# EasyEDA schematic CERBERUS 2100 EasyEDA Schematics.json

## Sheets
1 PSU/IO: TITLE: CERBERUS 2100™, power and interfaces; REV: 1.0; Date: 2023-06-28; Sheet: 1/5; Drawn By: Bernardo Kastrup; Company: The Byte Attic
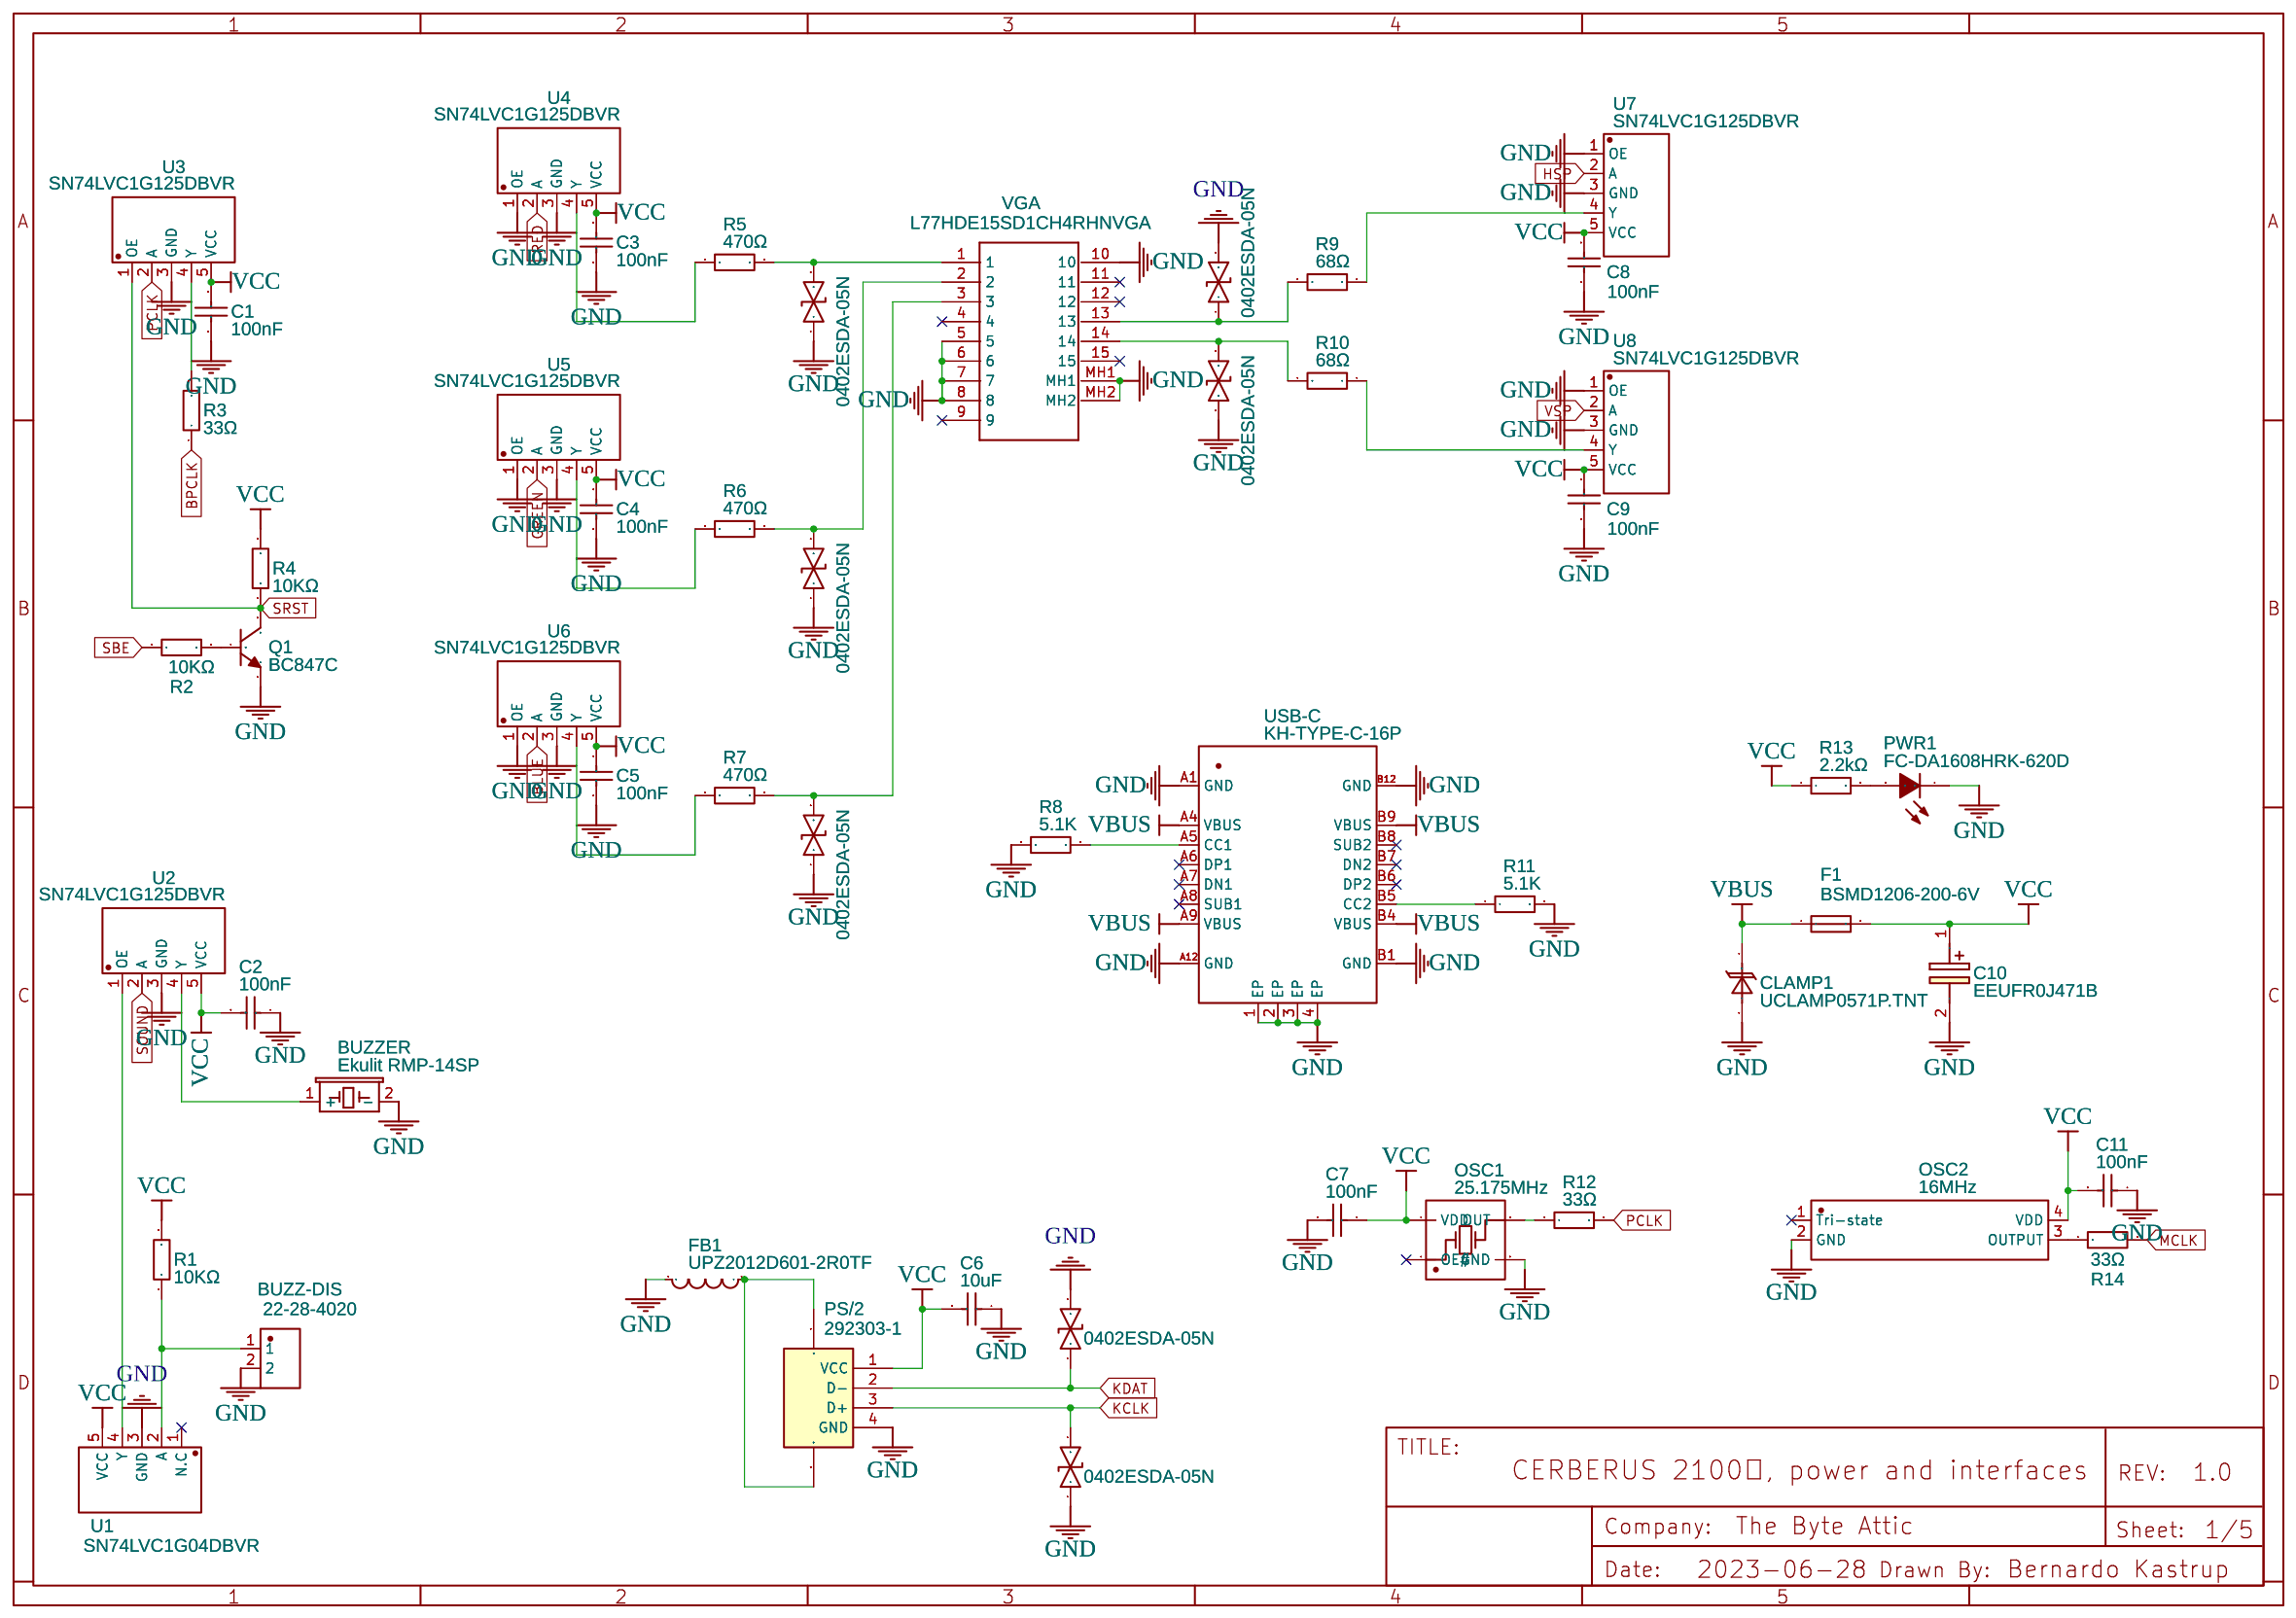
[diagram p0: PSU/IO]
2 VIDEO: TITLE: CERBERUS 2100™, video circuit; Sheet: 2/5
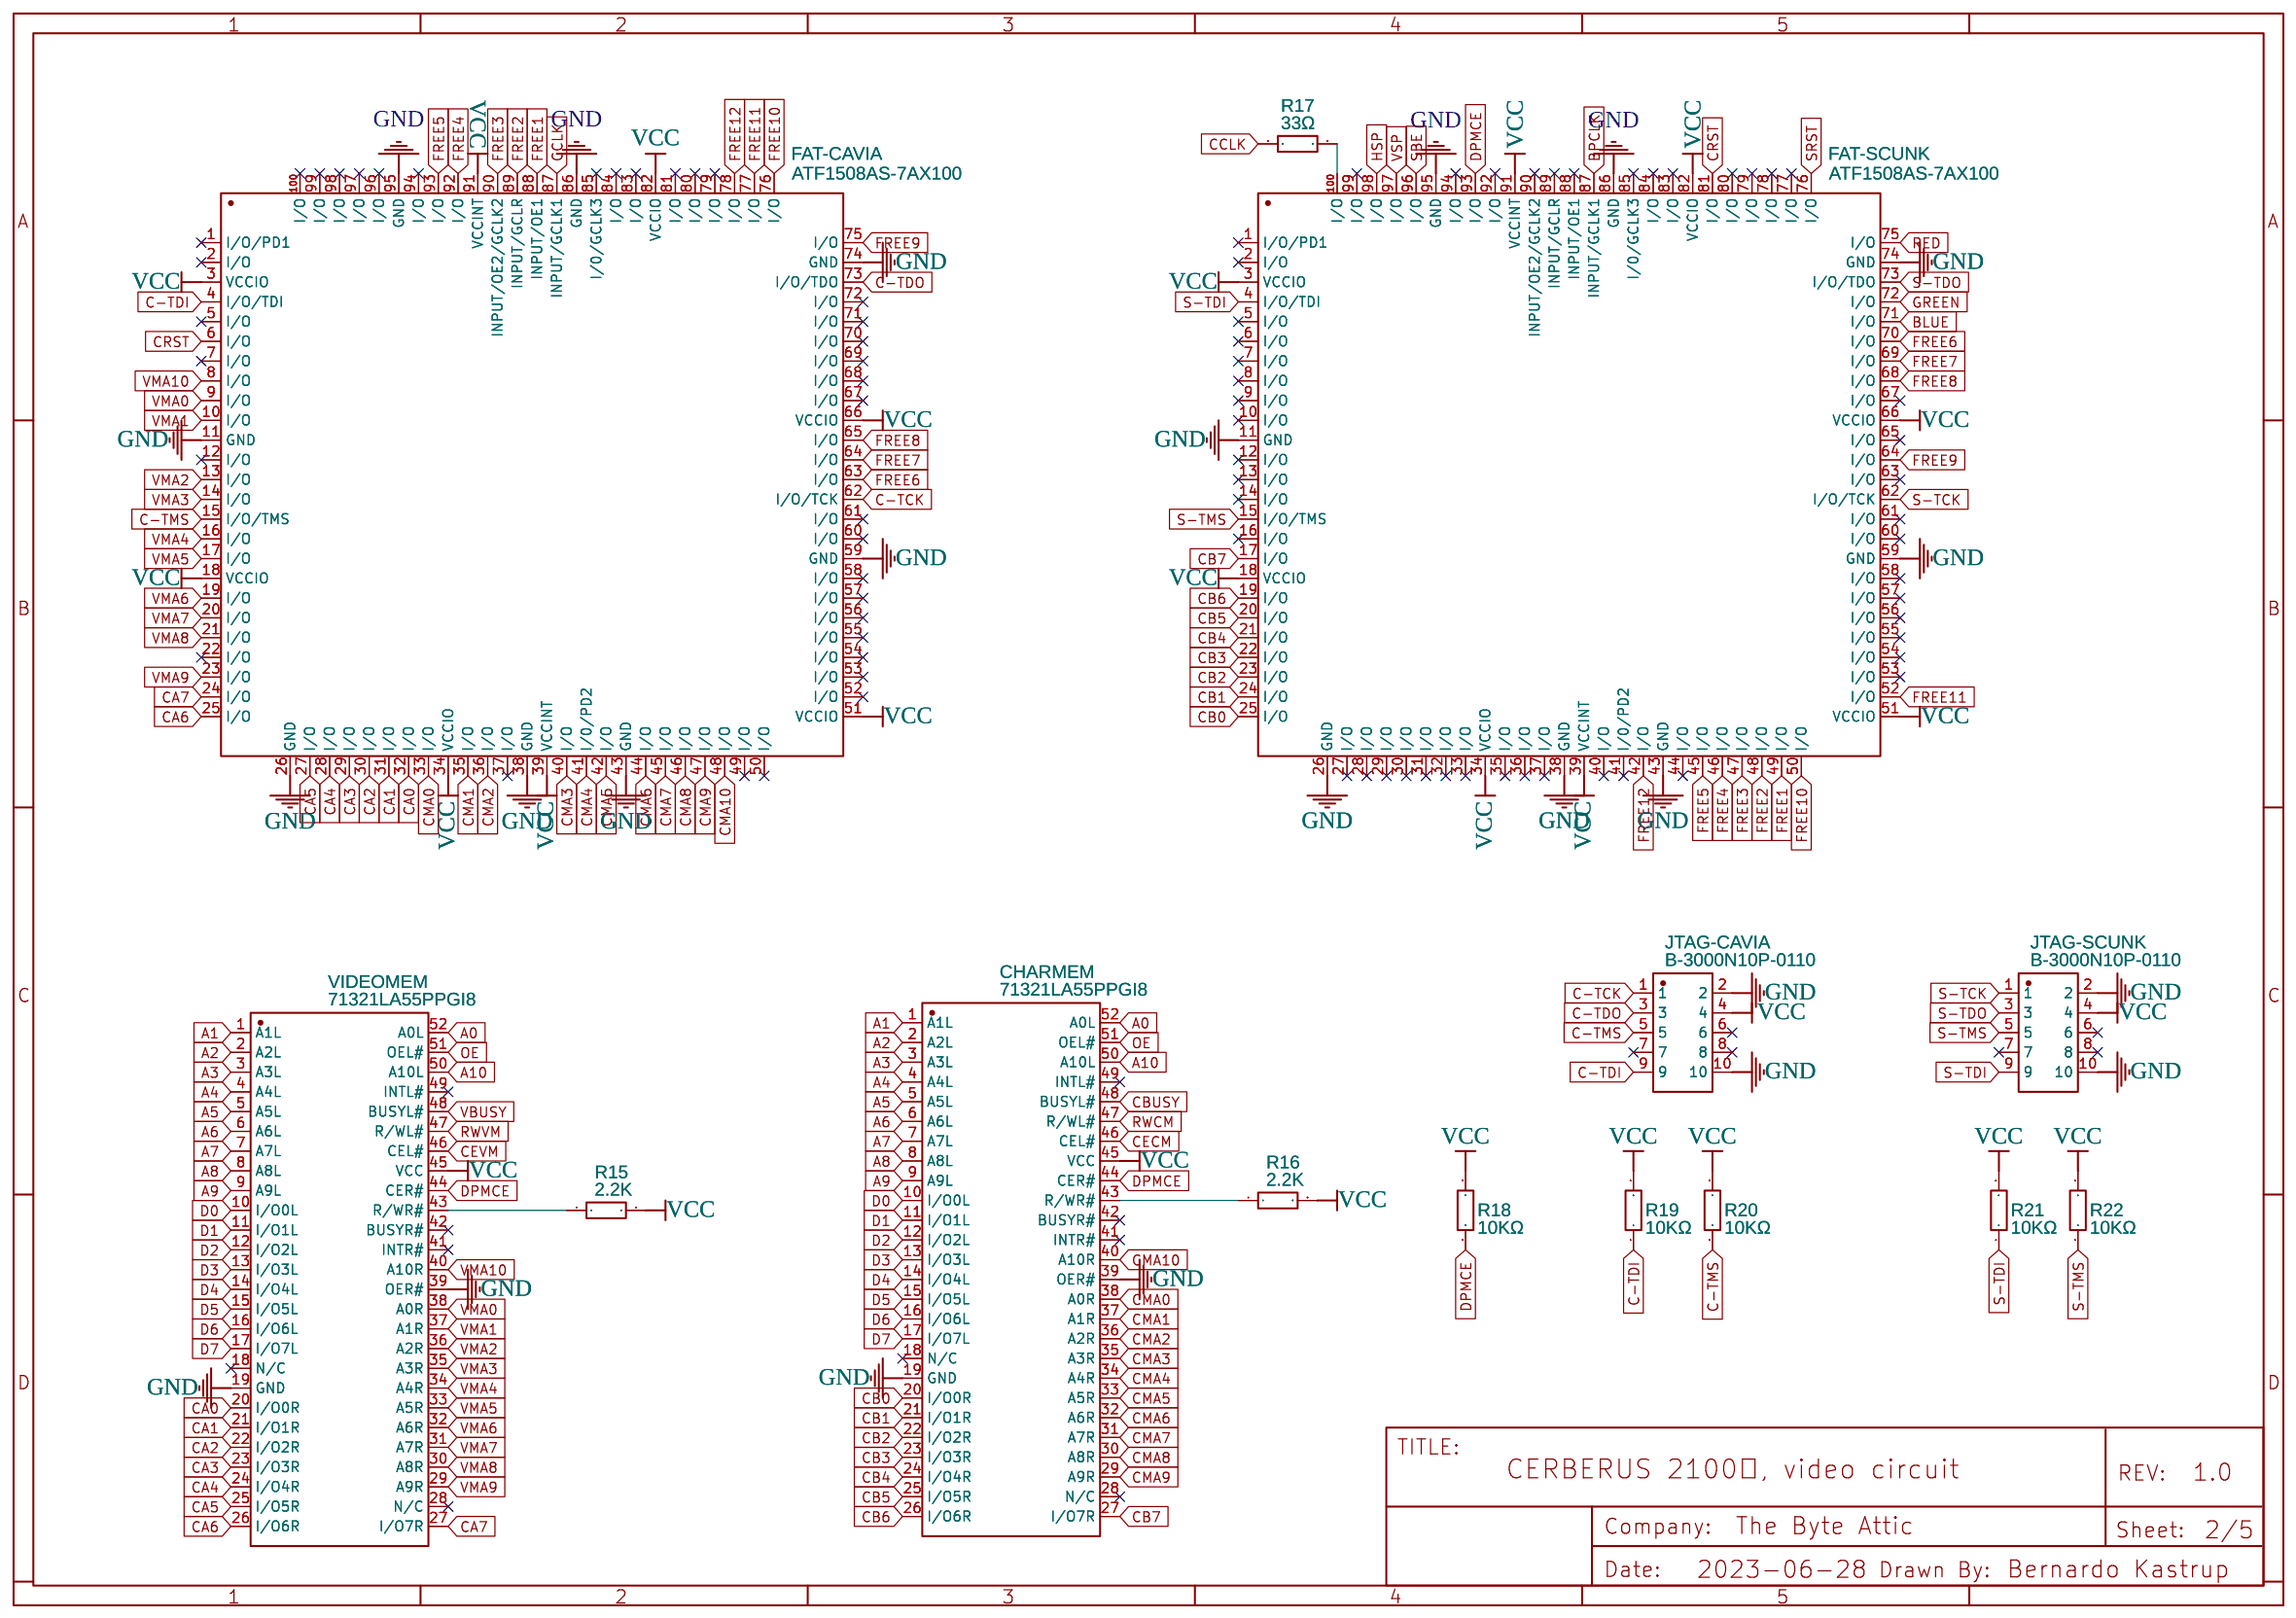
[diagram p1: VIDEO]
3 COMP: TITLE: CERBERUS 2100™, computer proper; Sheet: 3/5
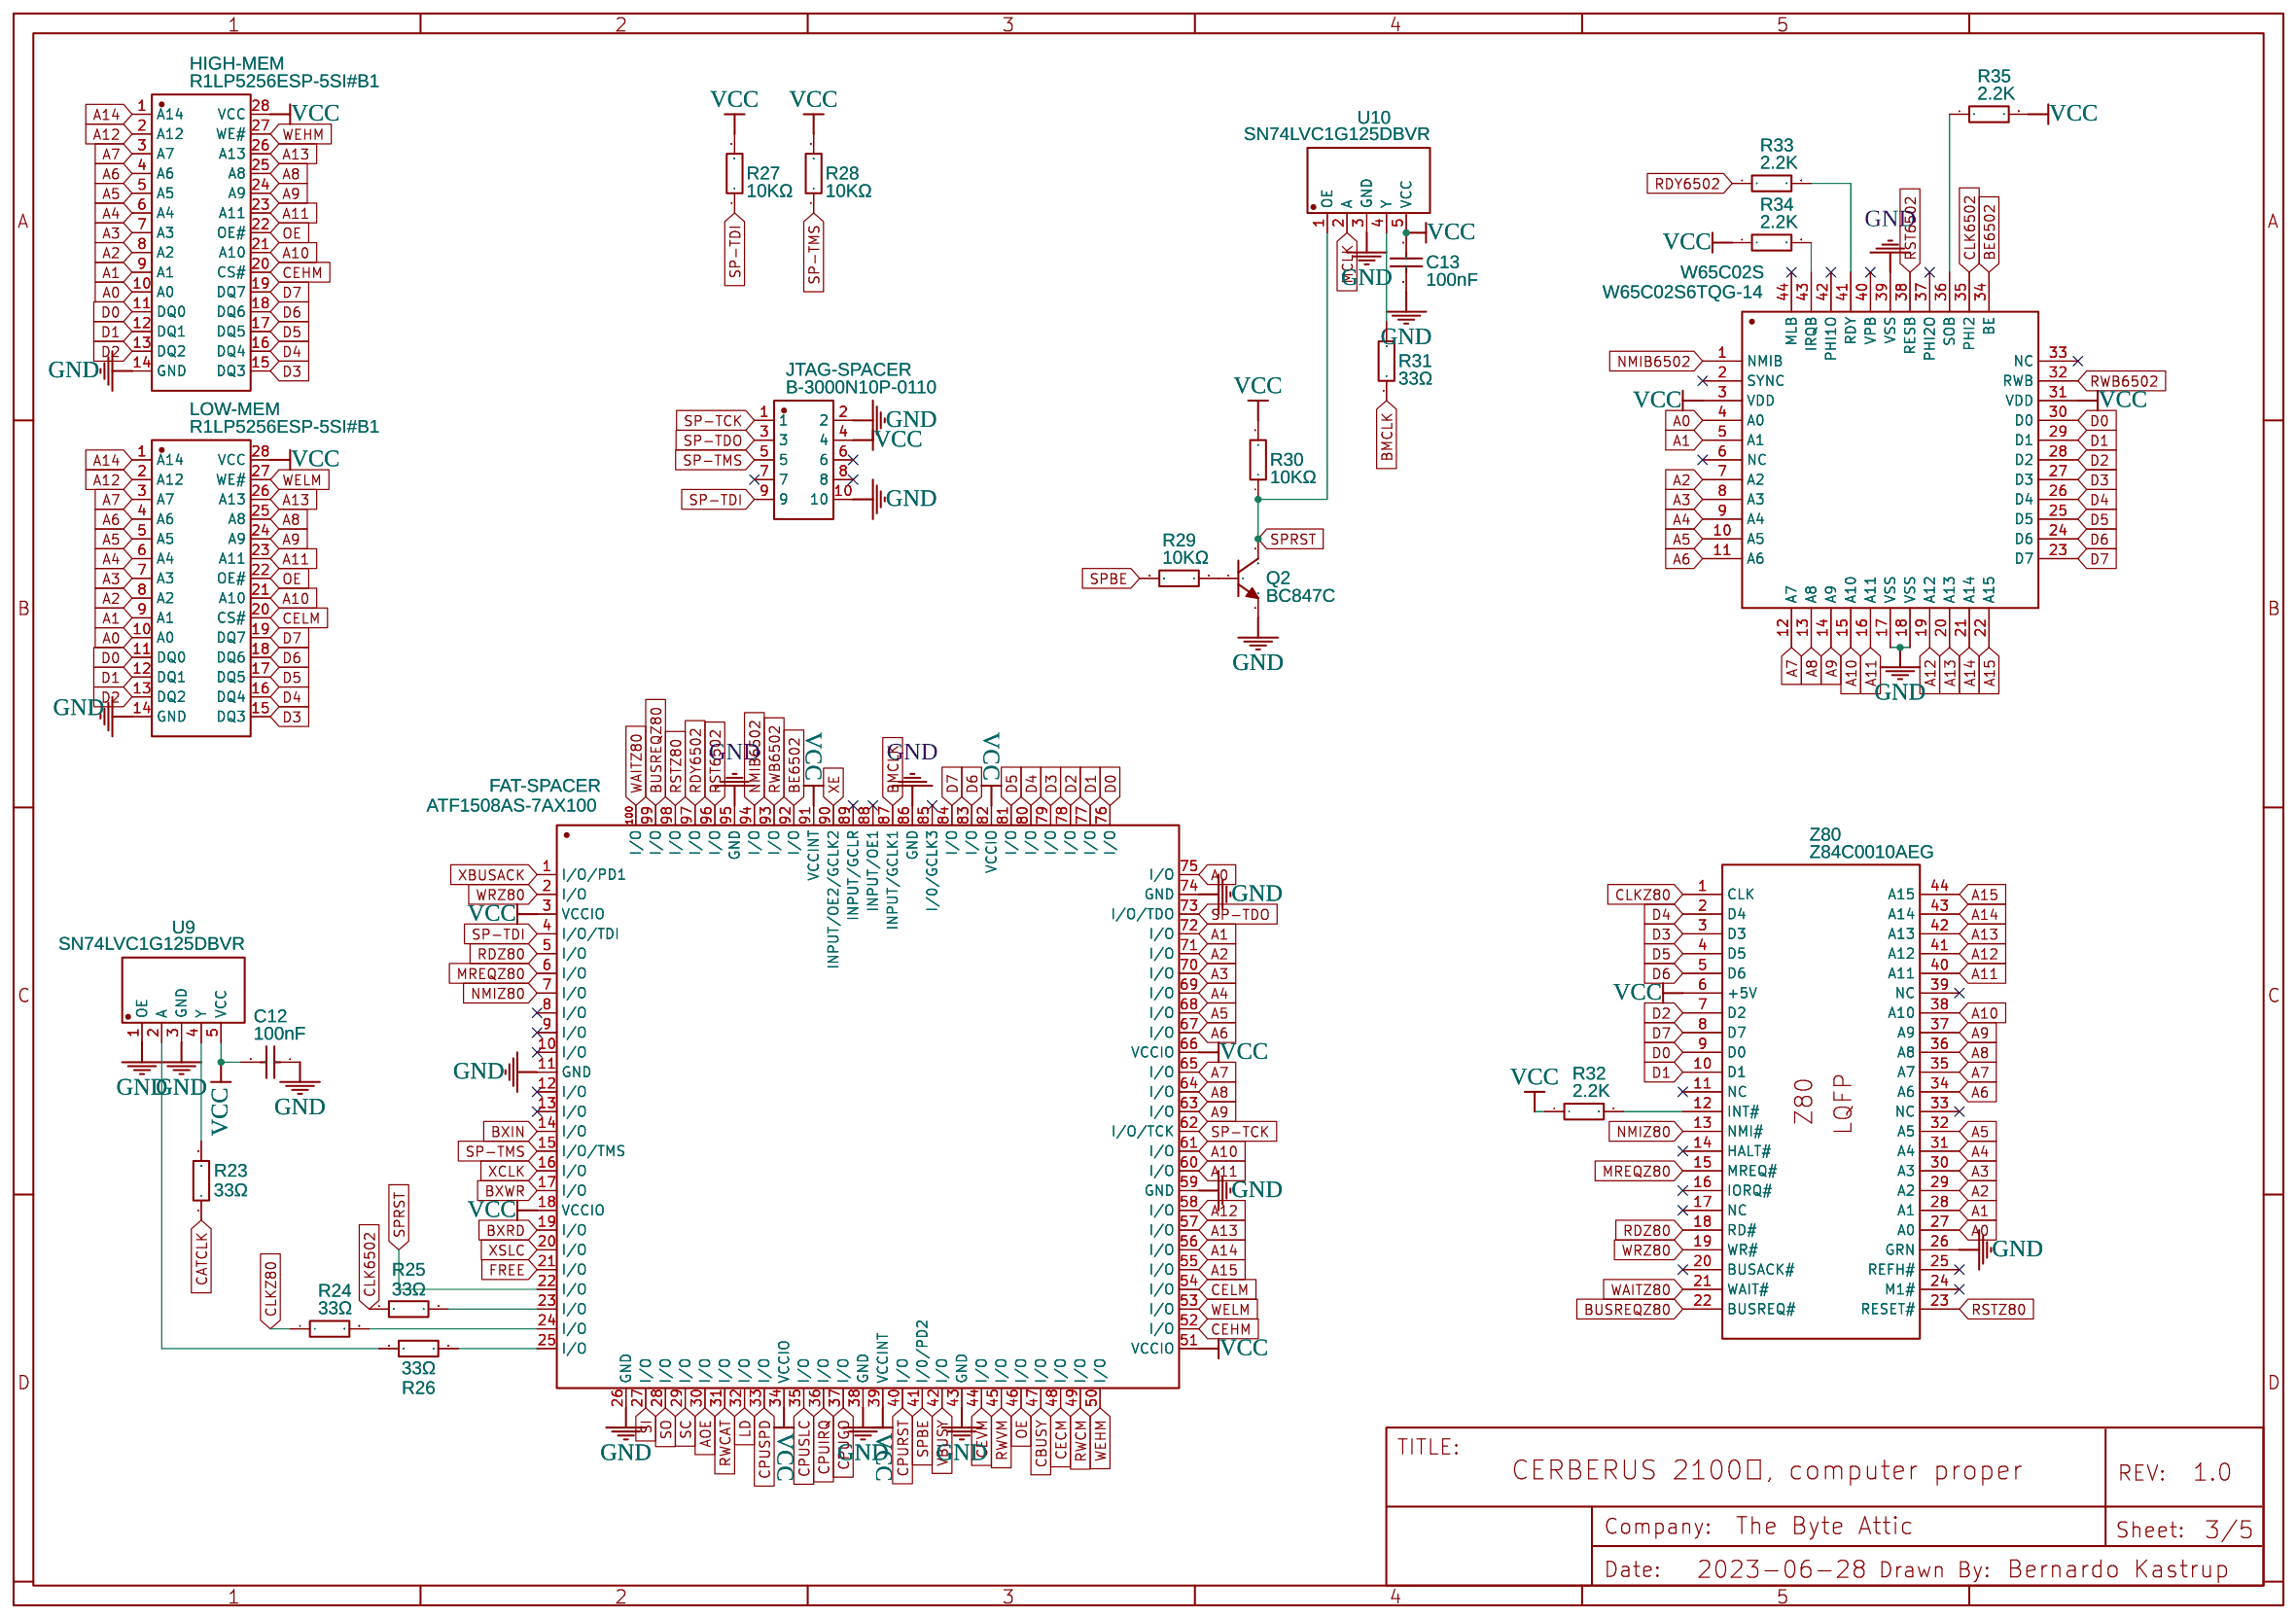
[diagram p2: COMP]
4 IO CTRL: TITLE: CERBERUS 2100™ I/O controller; Sheet: 4/5
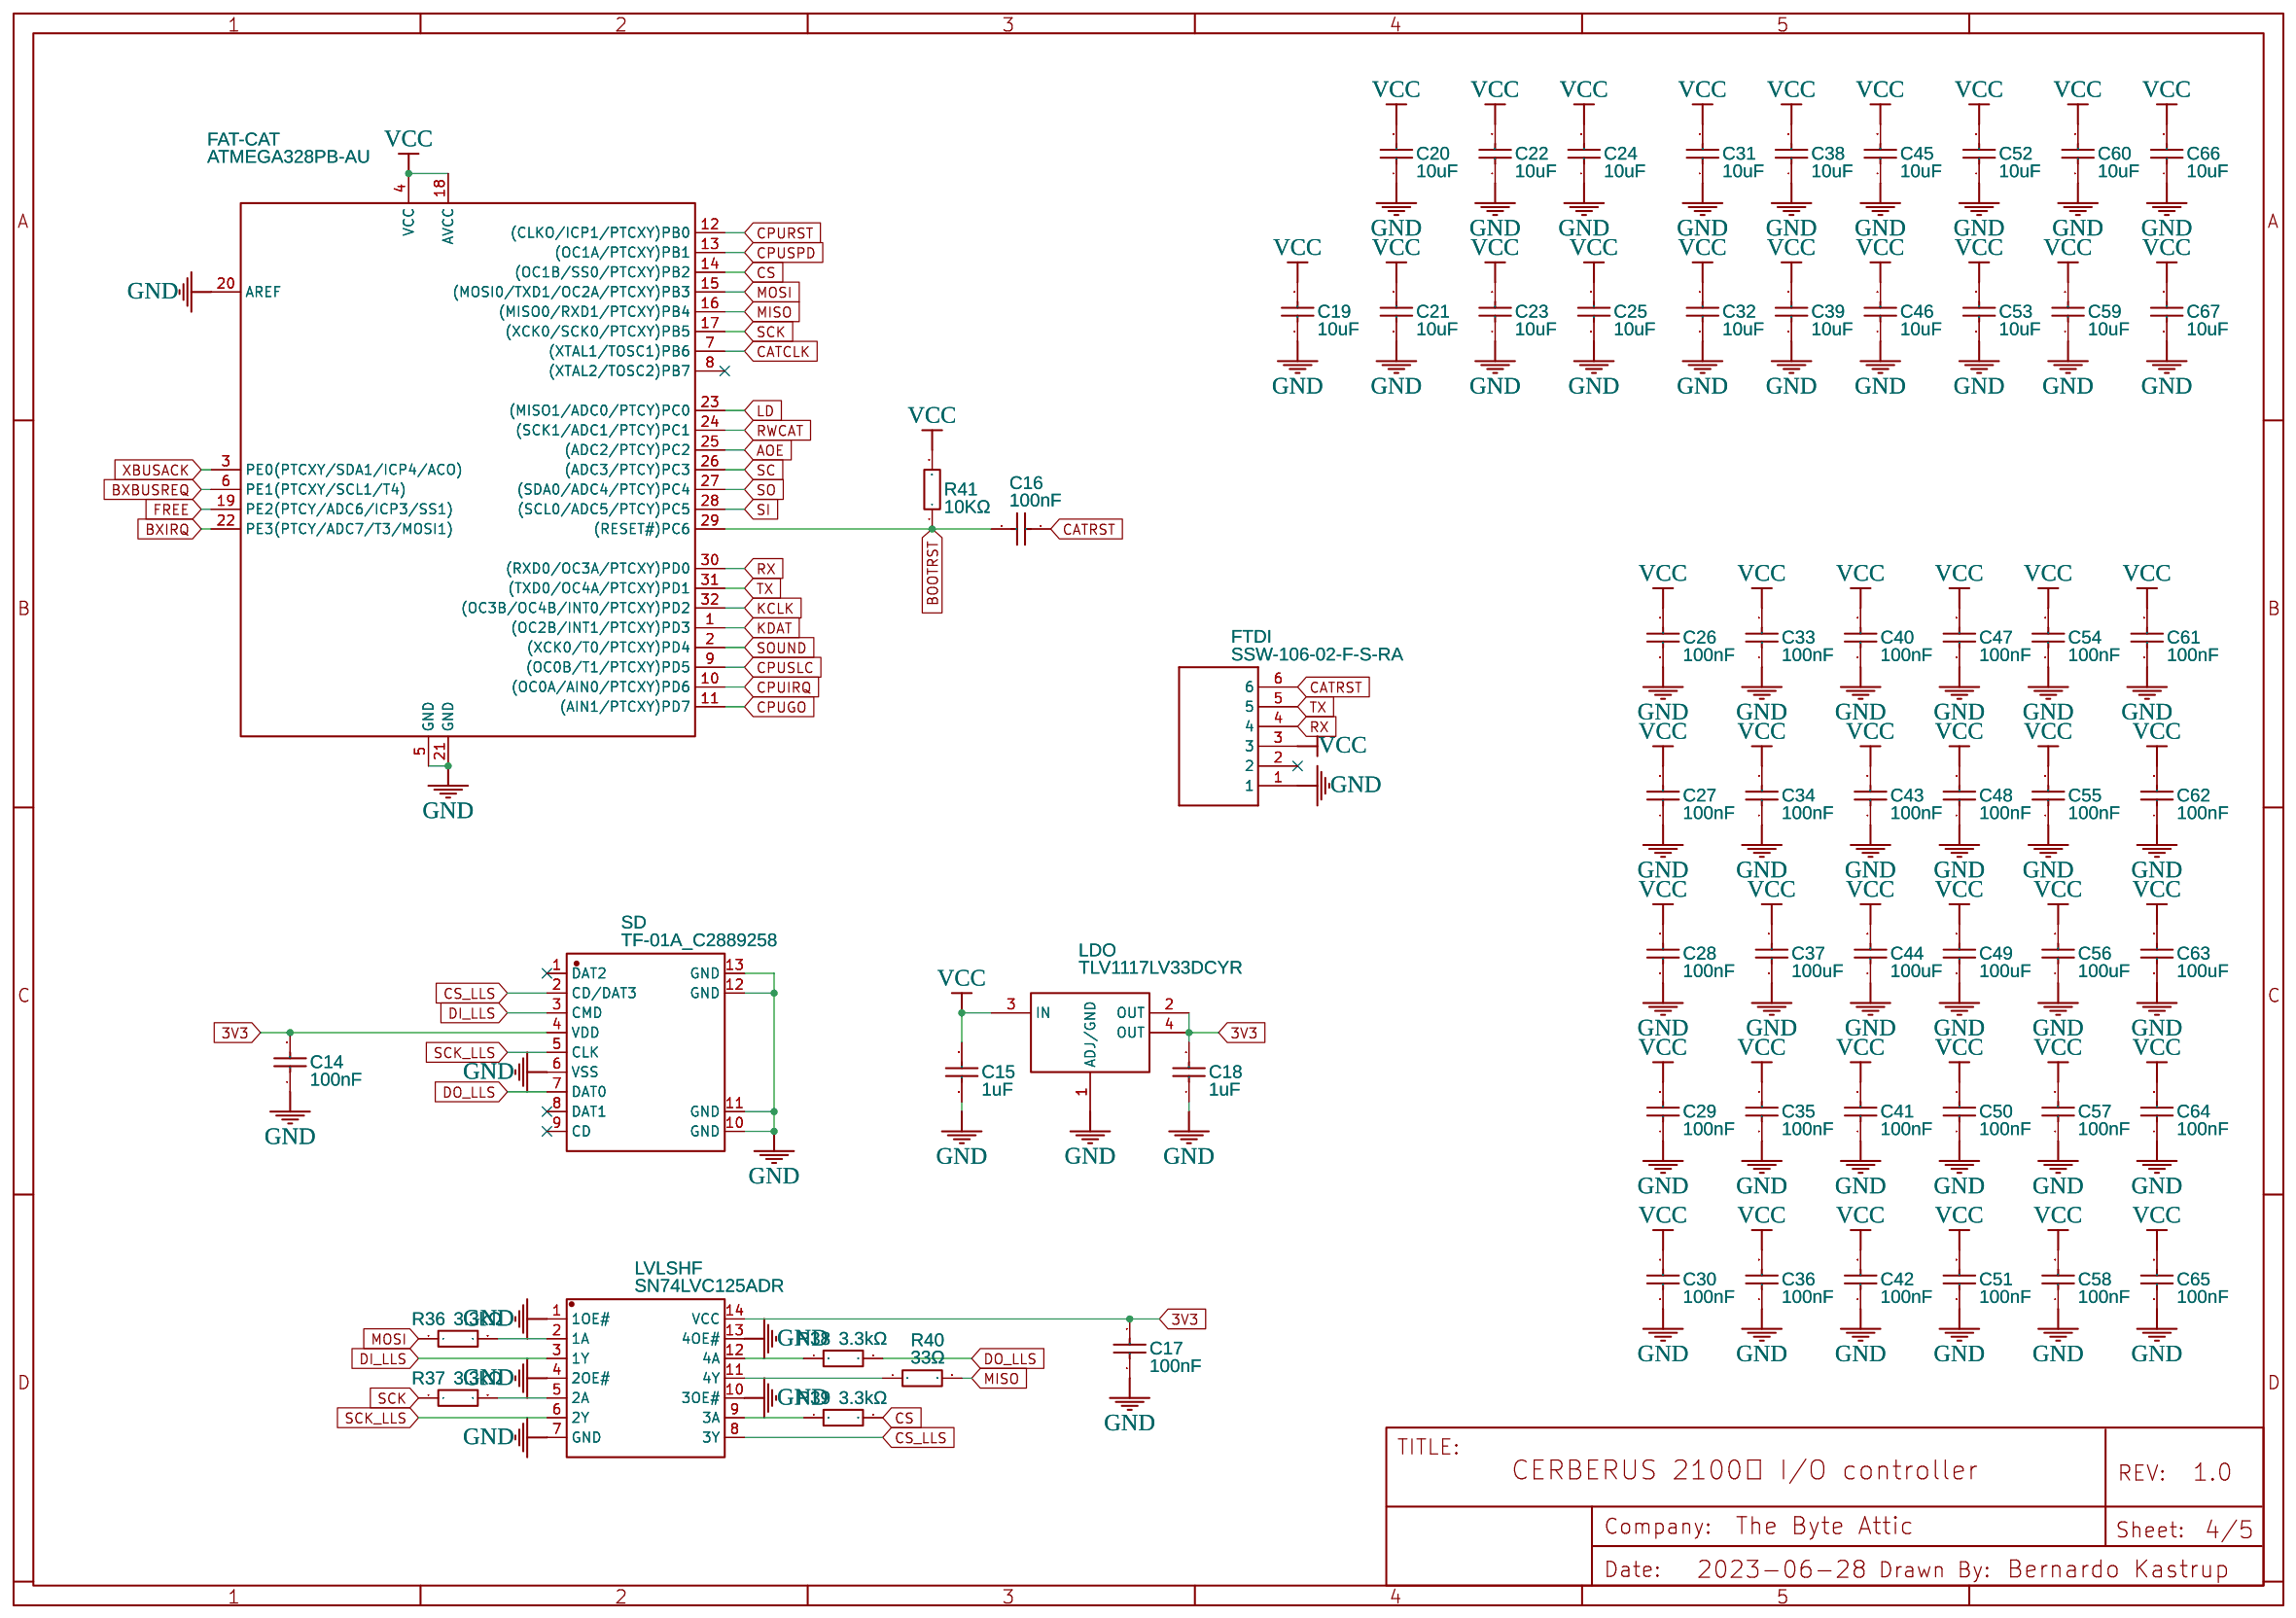
[diagram p3: IO CTRL]
5 EXP: TITLE: CERBERUS2080™, bus expansion; Sheet: 5/5
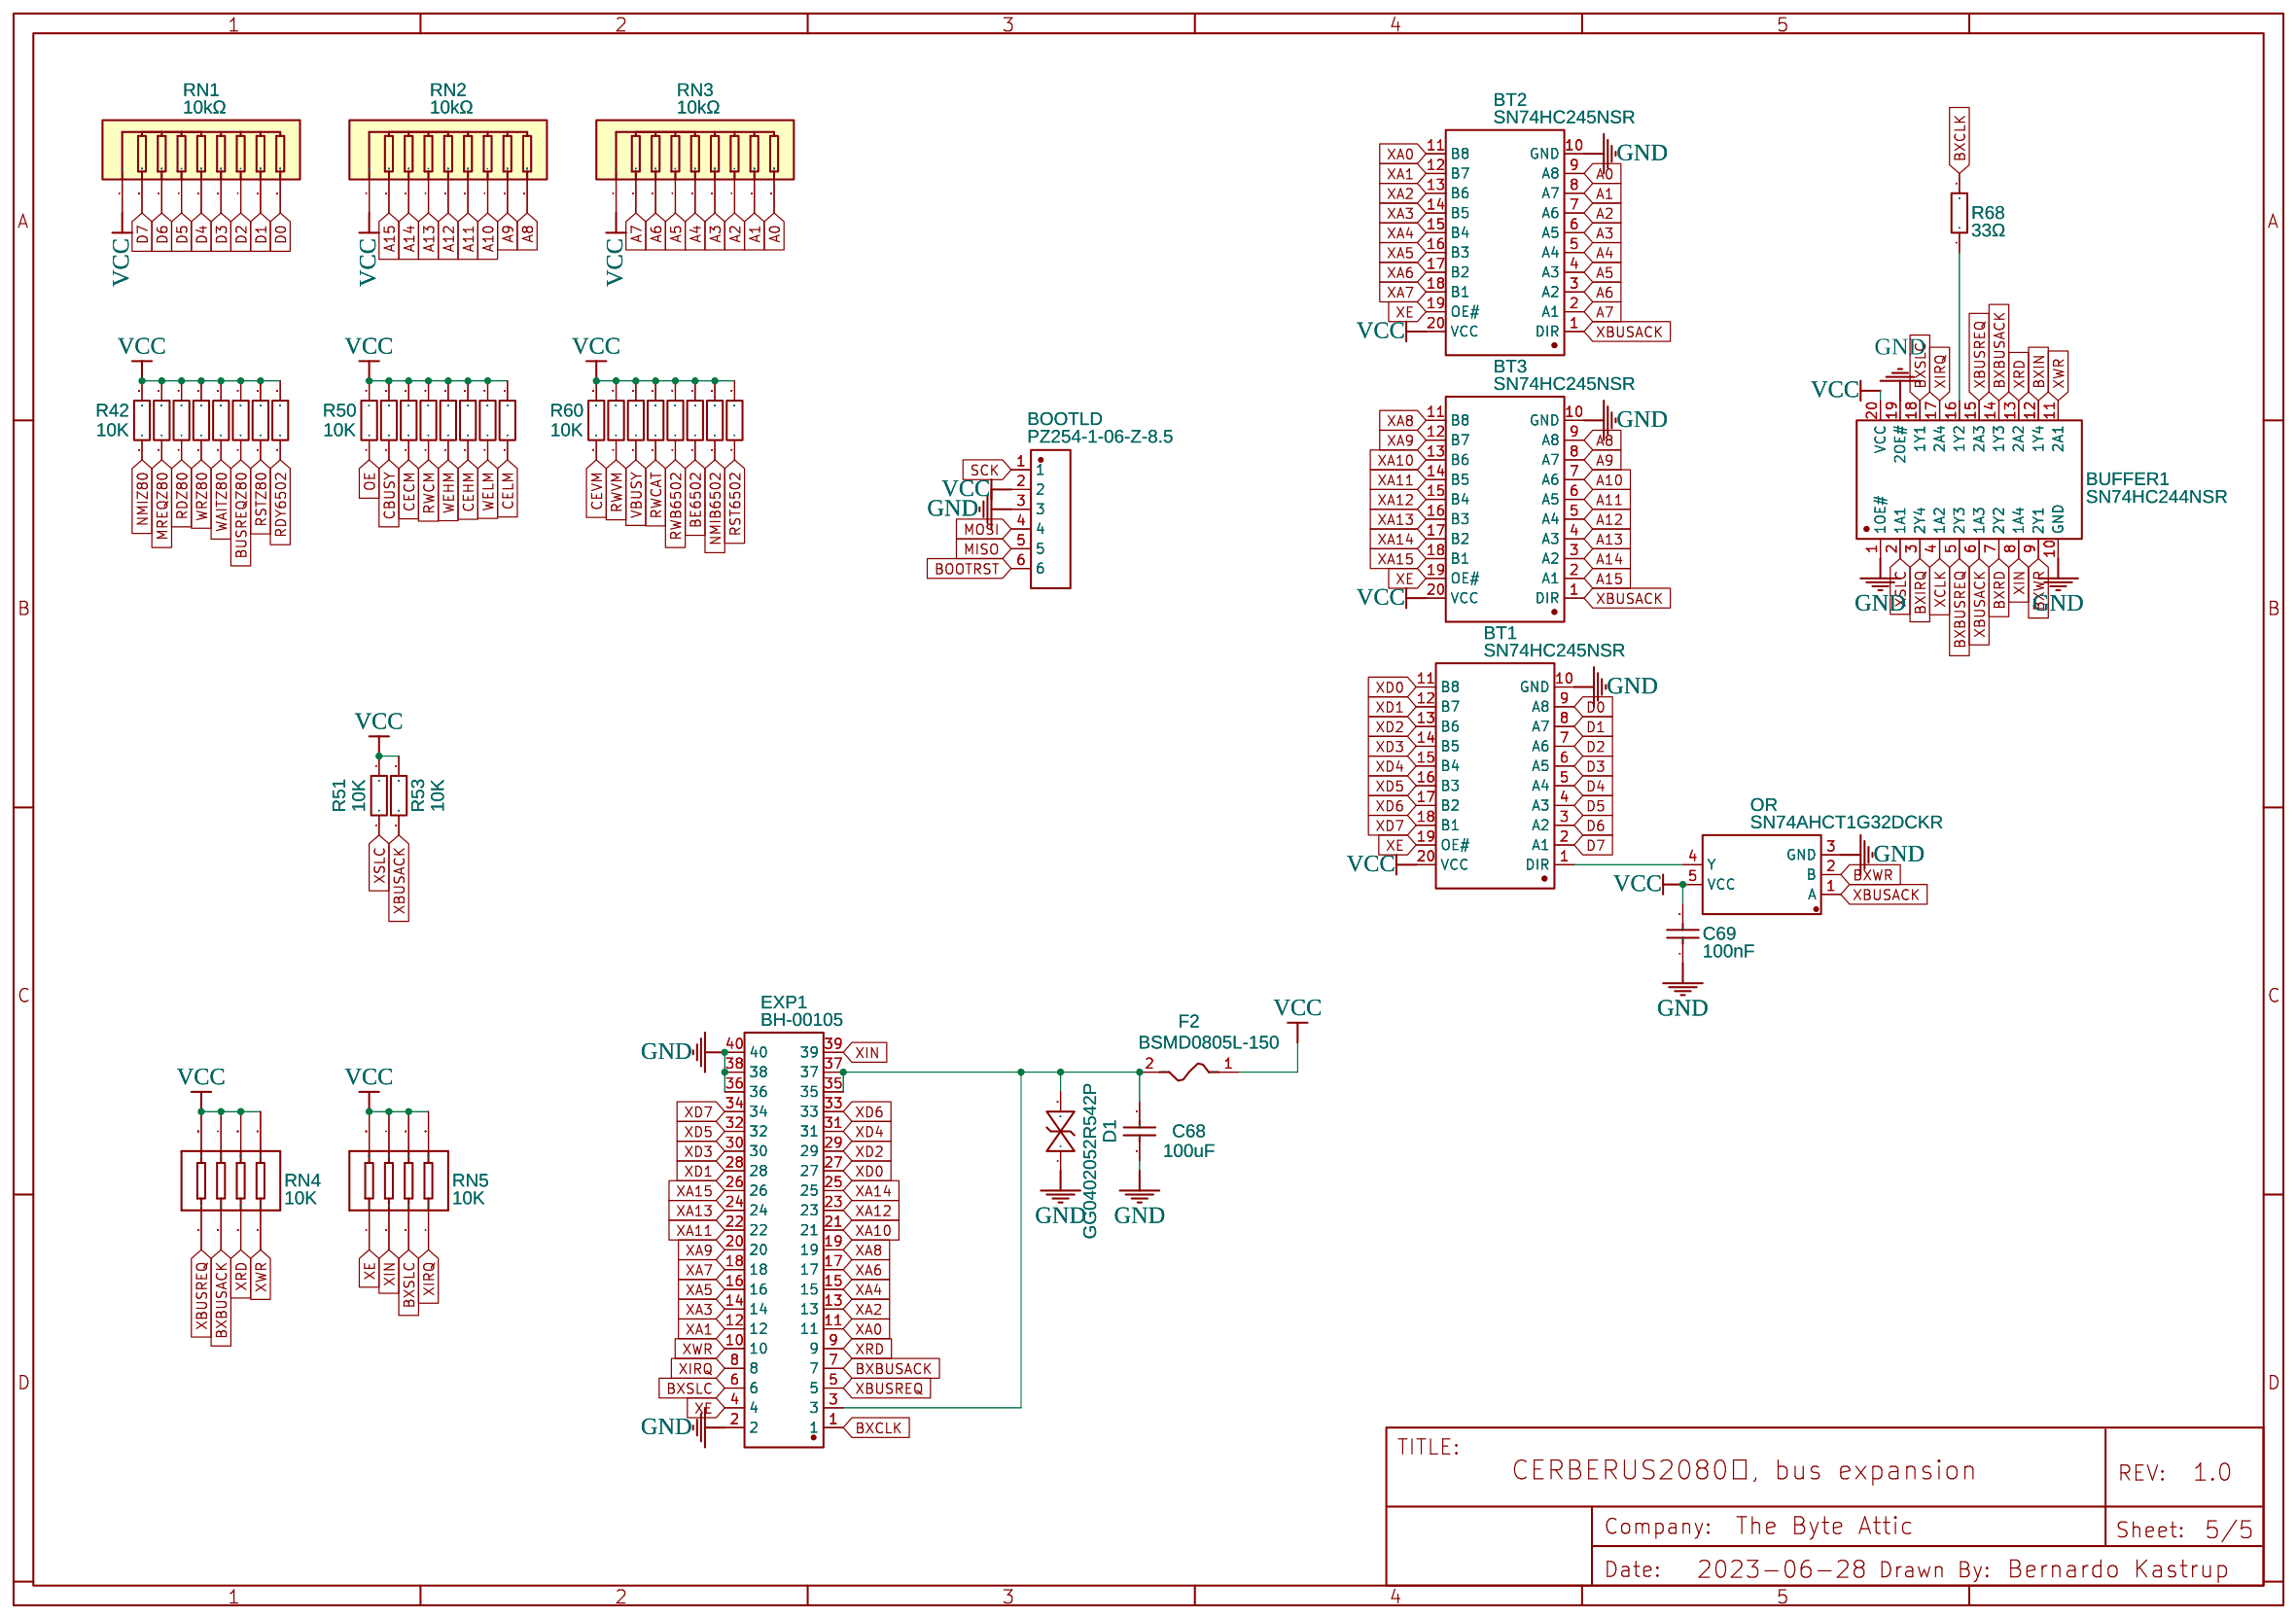
[diagram p4: EXP]

## Parts
sheet COMP
C12  100nF  [C0402_NEW]
C13  100nF  [C0402_NEW]
FAT-SPACER  ATF1508AS-7AX100  [TQFP-100_L14.0-W14.0-P0.50-LS16.0-BL]
HIGH-MEM  R1LP5256ESP-5SI#B1  [SOP-28_L17.5-W8.4-P1.27-LS12.0-BL]
JTAG-SPACER  B-3000N10P-0110  [CONN-SMD_10P-P2.54_B-3000N10P-0110]
LOW-MEM  R1LP5256ESP-5SI#B1  [SOP-28_L17.5-W8.4-P1.27-LS12.0-BL]
Q2  BC847C  [SOT-23-3_L2.9-W1.6-P1.90-LS2.8-BR]
R23  33Ω  [R0402]
R24  33Ω  [R0402]
R25  33Ω  [R0402]
R26  33Ω  [R0402]
R27  10KΩ  [R0402]
R28  10KΩ  [R0402]
R29  10KΩ  [R0402]
R30  10KΩ  [R0402]
R31  33Ω  [R0402]
R32  2.2K  [R0402]
R33  2.2K  [R0402]
R34  2.2K  [R0402]
R35  2.2K  [R0402]
U9  SN74LVC1G125DBVR  [SOT-23-5_L3.0-W1.7-P0.95-LS2.8-BR]
U10  SN74LVC1G125DBVR  [SOT-23-5_L3.0-W1.7-P0.95-LS2.8-BR]
W65C02S  W65C02S6TQG-14  [LQFP-44_L10.0-W10.0-P0.80-LS13.6-BL]
Z80  Z84C0010AEG  [LQFP-44_L10.0-W10.0-P0.80-LS13.6-BL]
sheet EXP
BOOTLD  PZ254-1-06-Z-8.5  [HDR-TH_06P-P2.54-V-M]
BT1  SN74HC245NSR  [SOIC-20_L13.3-W5.5-P1.27-LS7.8-BL]
BT2  SN74HC245NSR  [SOIC-20_L13.3-W5.5-P1.27-LS7.8-BL]
BT3  SN74HC245NSR  [SOIC-20_L13.3-W5.5-P1.27-LS7.8-BL]
BUFFER1  SN74HC244NSR  [SOIC-20_L13.3-W5.5-P1.27-LS7.8-BL]
C68  100uF  [C1210]
C69  100nF  [C0402_NEW]
D1  GG0402052R542P  [D0402-BI]
EXP1  BH-00105  [IDC-SMD_BH-00105]
F2  BSMD0805L-150  [F0805]
OR  SN74AHCT1G32DCKR  [SC-70-5_L2.1-W1.3-P0.65-LS2.1-BL]
R42  10K  [R0402]
R43  10K  [R0402]
R44  10K  [R0402]
R45  10K  [R0402]
R46  10K  [R0402]
R47  10K  [R0402]
R48  10K  [R0402]
R49  10K  [R0402]
R50  10K  [R0402]
R51  10K  [R0402]
R52  10K  [R0402]
R53  10K  [R0402]
R54  10K  [R0402]
R55  10K  [R0402]
R56  10K  [R0402]
R57  10K  [R0402]
R58  10K  [R0402]
R59  10K  [R0402]
R60  10K  [R0402]
R61  10K  [R0402]
R62  10K  [R0402]
R63  10K  [R0402]
R64  10K  [R0402]
R65  10K  [R0402]
R66  10K  [R0402]
R67  10K  [R0402]
R68  33Ω  [R0402]
RN1  10kΩ  [RES-ARRAY-TH_9P-P2.54-D1.0]
RN2  10kΩ  [RES-ARRAY-TH_9P-P2.54-D1.0]
RN3  10kΩ  [RES-ARRAY-TH_9P-P2.54-D1.0]
RN4  10K  [RES-ARRAY-SMD_0603-8P-L3.2-W1.6-BL]
RN5  10K  [RES-ARRAY-SMD_0603-8P-L3.2-W1.6-BL]
sheet IO CTRL
C14  100nF  [C0402_NEW]
C15  1uF  [C0402]
C16  100nF  [C0402_NEW]
C17  100nF  [C0402_NEW]
C18  1uF  [C0402]
C19  10uF  [C0402]
C20  10uF  [C0402]
C21  10uF  [C0402]
C22  10uF  [C0402]
C23  10uF  [C0402]
C24  10uF  [C0402]
C25  10uF  [C0402]
C26  100nF  [C0402_NEW]
C27  100nF  [C0402_NEW]
C28  100nF  [C0402_NEW]
C29  100nF  [C0402_NEW]
C30  100nF  [C0402_NEW]
C31  10uF  [C0402]
C32  10uF  [C0402]
C33  100nF  [C0402_NEW]
C34  100nF  [C0402_NEW]
C35  100nF  [C0402_NEW]
C36  100nF  [C0402_NEW]
C37  100uF  [C1210]
C38  10uF  [C0402]
C39  10uF  [C0402]
C40  100nF  [C0402_NEW]
C41  100nF  [C0402_NEW]
C42  100nF  [C0402_NEW]
C43  100nF  [C0402_NEW]
C44  100uF  [C1210]
C45  10uF  [C0402]
C46  10uF  [C0402]
C47  100nF  [C0402_NEW]
C48  100nF  [C0402_NEW]
C49  100uF  [C1210]
C50  100nF  [C0402_NEW]
C51  100nF  [C0402_NEW]
C52  10uF  [C0402]
C53  10uF  [C0402]
C54  100nF  [C0402_NEW]
C55  100nF  [C0402_NEW]
C56  100uF  [C1210]
C57  100nF  [C0402_NEW]
C58  100nF  [C0402_NEW]
C59  10uF  [C0402]
C60  10uF  [C0402]
C61  100nF  [C0402_NEW]
C62  100nF  [C0402_NEW]
C63  100uF  [C1210]
C64  100nF  [C0402_NEW]
C65  100nF  [C0402_NEW]
C66  10uF  [C0402]
C67  10uF  [C0402]
FAT-CAT  ATMEGA328PB-AU  [TQFP-32_L7.0-W7.0-P0.80-LS9.0-BL]
FTDI  SSW-106-02-F-S-RA  [SSW-106-XX-YYY-S-RA]
LDO  TLV1117LV33DCYR  [SOT-223_L6.7-W3.5-P2.30-BR]
LVLSHF  SN74LVC125ADR  [SOIC-14_L8.7-W3.9-P1.27-LS6.0-BL]
R36  3.3kΩ  [R0402]
R37  3.3kΩ  [R0402]
R38  3.3kΩ  [R0402]
R39  3.3kΩ  [R0402]
R40  33Ω  [R0402]
R41  10KΩ  [R0402]
SD  TF-01A_C2889258  [TF-SMD_TF-02]
sheet PSU/IO
BUZZ-DIS  22-28-4020  [HDR-TH_2P-P2.54-V-M-1]
BUZZER  Ekulit RMP-14SP  [BUZZER-R14-2P-7.6PITCH]
C1  100nF  [C0402_NEW]
C2  100nF  [C0402_NEW]
C3  100nF  [C0402_NEW]
C4  100nF  [C0402_NEW]
C5  100nF  [C0402_NEW]
C6  10uF  [C0402]
C7  100nF  [C0402_NEW]
C8  100nF  [C0402_NEW]
C9  100nF  [C0402_NEW]
C10  EEUFR0J471B  [CAPPRD250W55D630H1270]
C11  100nF  [C0402_NEW]
CLAMP1  UCLAMP0571P.TNT  [SGP1610N2_L1.6-W1.0-P1.1-RD]
ESD1  0402ESDA-05N  [D0402-BI]
ESD2  0402ESDA-05N  [D0402-BI]
ESD3  0402ESDA-05N  [D0402-BI]
ESD4  0402ESDA-05N  [D0402-BI]
ESD5  0402ESDA-05N  [D0402-BI]
ESD6  0402ESDA-05N  [D0402-BI]
ESD7  0402ESDA-05N  [D0402-BI]
F1  BSMD1206-200-6V  [F1206]
FB1  UPZ2012D601-2R0TF  [L0805]
OSC1  25.175MHz  [OSC-SMD_4P-L7.0-W5.0-BL]
OSC2  16MHz  [OSC-SMD_4P-L7.0-W5.0-BL]
PS/2  292303-1  [USB-A-TH_USB-302-T]
PWR1  FC-DA1608HRK-620D  [LED0603-RD_RED]
Q1  BC847C  [SOT-23-3_L2.9-W1.6-P1.90-LS2.8-BR]
R1  10KΩ  [R0402]
R2  10KΩ  [R0402]
R3  33Ω  [R0402]
R4  10KΩ  [R0402]
R5  470Ω  [R0603]
R6  470Ω  [R0603]
R7  470Ω  [R0603]
R8  5.1K  [R0603]
R9  68Ω  [R0402]
R10  68Ω  [R0402]
R11  5.1K  [R0603]
R12  33Ω  [R0402]
R13  2.2kΩ  [R0603]
R14  33Ω  [R0402]
U1  SN74LVC1G04DBVR  [SOT-23-5_L3.0-W1.7-P0.95-LS2.8-BR]
U2  SN74LVC1G125DBVR  [SOT-23-5_L3.0-W1.7-P0.95-LS2.8-BR]
U3  SN74LVC1G125DBVR  [SOT-23-5_L3.0-W1.7-P0.95-LS2.8-BR]
U4  SN74LVC1G125DBVR  [SOT-23-5_L3.0-W1.7-P0.95-LS2.8-BR]
U5  SN74LVC1G125DBVR  [SOT-23-5_L3.0-W1.7-P0.95-LS2.8-BR]
U6  SN74LVC1G125DBVR  [SOT-23-5_L3.0-W1.7-P0.95-LS2.8-BR]
U7  SN74LVC1G125DBVR  [SOT-23-5_L3.0-W1.7-P0.95-LS2.8-BR]
U8  SN74LVC1G125DBVR  [SOT-23-5_L3.0-W1.7-P0.95-LS2.8-BR]
USB-C  KH-TYPE-C-16P  [USB-C-SMD_KH-TYPE-C-16P]
VGA  L77HDE15SD1CH4RHNVGA  [L77HDE15SD1CH4RHNVGA]
sheet VIDEO
CHARMEM  71321LA55PPGI8  [LQFP-52_L10.0-W10.0-P0.65-LS12.0-BL]
FAT-CAVIA  ATF1508AS-7AX100  [TQFP-100_L14.0-W14.0-P0.50-LS16.0-BL]
FAT-SCUNK  ATF1508AS-7AX100  [TQFP-100_L14.0-W14.0-P0.50-LS16.0-BL]
JTAG-CAVIA  B-3000N10P-0110  [CONN-SMD_10P-P2.54_B-3000N10P-0110]
JTAG-SCUNK  B-3000N10P-0110  [CONN-SMD_10P-P2.54_B-3000N10P-0110]
R15  2.2K  [R0402]
R16  2.2K  [R0402]
R17  33Ω  [R0402]
R18  10KΩ  [R0402]
R19  10KΩ  [R0402]
R20  10KΩ  [R0402]
R21  10KΩ  [R0402]
R22  10KΩ  [R0402]
VIDEOMEM  71321LA55PPGI8  [LQFP-52_L10.0-W10.0-P0.65-LS12.0-BL]

## Library data of the parts
C1-C5 C7-C9 C11-C14 C16 C17 C26-C30 C33-C36 C40-C43 C47 C48 C50 C51 C54 C55 C57 C58 C61 C62 C64 C65 C69 = CL05B104KO5NNNC: Supplier: LCSC; Manufacturer: SAMSUNG(三星); Supplier Part: C1525; JLCPCB Part Class: Basic Part
FAT-CAVIA FAT-SCUNK FAT-SPACER = ATF1508AS-10AU100: Supplier: Mouser; Supplier Part: 556-AF1508AS7AX100; Manufacturer: MICROCHIP; Contributor: LCSC; JLCPCB Part Class: Extended Part; Package Display: No
HIGH-MEM LOW-MEM = R1LP5256ESP-5SI#B1: Supplier: LCSC; Supplier Part: C1136813; Manufacturer: RENESAS(瑞萨)/IDT; Contributor: LCSC; JLCPCB Part Class: Extended Part
JTAG-CAVIA JTAG-SCUNK JTAG-SPACER = B-3000N10P-0110: Supplier: LCSC; Supplier Part: C383605; Manufacturer: Ckmtw(灿科盟); Contributor: LCSC; JLCPCB Part Class: Extended Part; Package Display: No
Q1 Q2 = BC847C: Supplier: LCSC; Manufacturer: Hottech(合科泰); Contributor: LCSC; Supplier Part: C181141; JLCPCB Part Class: Extended Part
R3 R12 R14 R17 R23-R26 R31 R40 R68 = 0402WGF330JTCE: Supplier: LCSC; Manufacturer: UNI-ROYAL(厚声); Supplier Part: C25105; Resistance (Ohms): 33; JLCPCB Part Class: Basic Part
R1 R2 R4 R18-R22 R27-R30 R41-R50 R52 R54-R67 = RC0402FR-0710KL: Supplier: LCSC; Manufacturer: YAGEO(国巨); Supplier Part: C60490; JLCPCB Part Class: Extended Part; Resistance: 10kΩ
R15 R16 R32-R35 = RC0402FR-072K2L: Supplier: LCSC; Manufacturer: YAGEO(国巨); Supplier Part: C114762; JLCPCB Part Class: Extended Part; Resistance: 2.2kΩ
U2-U10 = SN74LVC1G125DBVR: Supplier: LCSC; Manufacturer: TI(德州仪器); Supplier Part: C23654; JLCPCB Part Class: Extended Part
W65C02S = W65C02S6TQG-14: Manufacturer: Western Design Center (WDC); Supplier: Mouser; Supplier Part: 955-W65C02S6TQG-14; link: https://www.mouser.es/ProductDetail/Western-Design-Center-WDC/W65C02S6TQG-14?qs=opBjA1TV900Cx5CoX8hQeQ%3D%3D; Contributor: LukasJele; Package Display: No
Z80 = Z80 LQFP 44: Manufacturer: Zilog; Supplier: Mouser; Supplier Part: 692-Z84C0010AEG; link: https://www.digikey.co.uk/product-detail/en/zilog/Z84C0010AEG/269-4574-ND/1236499; Contributor: Mjs73; Package Display: No
BOOTLD = PZ254-1-06-Z-8.5: Supplier: LCSC; Supplier Part: C2894929; Manufacturer: HCTL(华灿天禄); Contributor: LCSC; JLCPCB Part Class: Extended Part
BT1-BT3 = SN74HC245NSR: Supplier: LCSC; Manufacturer: TI(德州仪器); Supplier Part: C88578; JLCPCB Part Class: Extended Part
BUFFER1 = SN74HC244NSR: Supplier: LCSC; Manufacturer: TI(德州仪器); Supplier Part: C10094; JLCPCB Part Class: Extended Part
C37 C44 C49 C56 C63 C68 = CL32A107MPVNNNE: Supplier: LCSC; Manufacturer: SAMSUNG(三星); Supplier Part: C23742; JLCPCB Part Class: Extended Part
D1 = GG0402052R542P: Supplier: LCSC; Supplier Part: C1973257; Manufacturer: Kyocera AVX; Contributor: LCSC; JLCPCB Part Class: Extended Part
EXP1 = BH-00105: Supplier: LCSC; Supplier Part: C2685065; Manufacturer: Liansheng(连盛); Contributor: LCSC; JLCPCB Part Class: Extended Part
F2 = BSMD0805L-150: Supplier: LCSC; Supplier Part: C914095; Manufacturer: BHFUSE(佰宏); Contributor: LCSC; JLCPCB Part Class: Extended Part
OR = SN74AHCT1G32DCKR: Supplier: LCSC; Supplier Part: C350558; Manufacturer: TI(德州仪器); Contributor: LCSC; JLCPCB Part Class: Extended Part
R51 R53 = RC0402FR-0710KL: Supplier: LCSC; Manufacturer: YAGEO(国巨); Supplier Part: C60490; JLCPCB Part Class: Extended Part; Resistance: 10kΩ; Package Display: No
RN1-RN3 = A09-103JP: Supplier: LCSC; Manufacturer: FH(风华); Supplier Part: C8692; Resistance (Ohms): 10K; JLCPCB Part Class: Extended Part
RN4 RN5 = YC164-FR-0710KL: Supplier: LCSC; Manufacturer: YAGEO(国巨); Supplier Part: C110924; JLCPCB Part Class: Extended Part; Resistance: 10kΩ
C15 C18 = CL05A105KP5NNNC: Supplier: LCSC; Manufacturer: SAMSUNG(三星); Supplier Part: C14445; JLCPCB Part Class: Extended Part
C6 C19-C25 C31 C32 C38 C39 C45 C46 C52 C53 C59 C60 C66 C67 = CL05A106MQ5NUNC: Supplier: LCSC; Manufacturer: SAMSUNG(三星); Supplier Part: C15525; JLCPCB Part Class: Basic Part
FAT-CAT = ATMEGA328PB-AU: Supplier: LCSC; Manufacturer: MICROCHIP(美国微芯); Contributor: LCSC; Supplier Part: C132230; JLCPCB Part Class: Extended Part
FTDI = SSW-106-02-F-S-RA: Contributor: bkastrup
LDO = TLV1117LV33DCYR: Supplier: LCSC; Manufacturer: TI(德州仪器); Supplier Part: C15578; JLCPCB Part Class: Extended Part
LVLSHF = SN74LVC125ADR: Supplier: LCSC; Manufacturer: TI(德州仪器); Supplier Part: C7661; JLCPCB Part Class: Extended Part
R36-R39 = 0402WGF3301TCE: Supplier: LCSC; Manufacturer: UNI-ROYAL(厚声); Supplier Part: C25890; Resistance (Ohms): 3.3K; JLCPCB Part Class: Basic Part
SD = TF-01A_C2889258: Supplier: LCSC; Supplier Part: C2889258; Manufacturer: Yuandi(台湾元迪); Manufacturer Part: TF-01A; Contributor: LCSC; JLCPCB Part Class: Extended Part
BUZZ-DIS = 22-28-4020: Supplier: LCSC; Supplier Part: C234182; Manufacturer: MOLEX; Contributor: LCSC; JLCPCB Part Class: Extended Part
BUZZER = BUZZER Ekulit RMP-14SP: Manufacturer: Ekulit; Supplier Part: RMP-14SP; Contributor: bkastrup
C10 = EEUFR0J471B: Contributor: bkastrup; Manufacturer Part: EEU-FR0J471B; Package Display: No; Supplier: Mouser; Supplier Part: 667-EEU-FR0J471B; Manufacturer: Panasonic
CLAMP1 = UCLAMP0571P.TNT: Supplier: LCSC; Supplier Part: C512387; Manufacturer: SEMTECH; Contributor: LCSC; JLCPCB Part Class: Extended Part
ESD1-ESD7 = 0402ESDA-05N: Supplier: LCSC; Supplier Part: C316049; Manufacturer: Bourne Semicon (Shenzhen); Contributor: LCSC; JLCPCB Part Class: Extended Part; Package Display: No
F1 = BSMD1206-200-6V: Supplier: LCSC; Supplier Part: C883134; Manufacturer: BHFUSE(佰宏); Contributor: LCSC; JLCPCB Part Class: Extended Part
FB1 = UPZ2012D601-2R0TF: Supplier: LCSC; Supplier Part: C370578; Manufacturer: Sunlord(顺络); Contributor: LCSC; JLCPCB Part Class: Extended Part
OSC1 = S7D25.175000A20F30T: Supplier: LCSC; Supplier Part: C387038; Manufacturer: SCTF(星通时频); Contributor: LCSC; JLCPCB Part Class: Extended Part
OSC2 = S7D16.000000A20F30T: Supplier: LCSC; Supplier Part: C386991; Manufacturer: SCTF(星通时频); Contributor: LCSC; JLCPCB Part Class: Extended Part
PS/2 = 292303-1: Supplier: LCSC; Manufacturer: TE Connectivity; Supplier Part: C86461; JLCPCB Part Class: Extended Part
PWR1 = FC-DA1608HRK-620D: Supplier: LCSC; Manufacturer: 国星光电; Manufacturer Part: NCD0603R1; Supplier Part: C84263; JLCPCB Part Class: Extended Part
R5-R7 = 0603WAF4700T5E: Supplier: LCSC; Manufacturer: UNI-ROYAL(厚声); Supplier Part: C23179; Resistance (Ohms): 470; JLCPCB Part Class: Basic Part
R8 R11 = RC0603FR-075K1L: Supplier: LCSC; Manufacturer: YAGEO(国巨); Supplier Part: C105580; JLCPCB Part Class: Extended Part; Resistance: 5.1kΩ
R9 R10 = RC0402FR-0768RL: Supplier: LCSC; Manufacturer: YAGEO(国巨); Contributor: LCSC; Supplier Part: C163455; JLCPCB Part Class: Extended Part
R13 = 0603WAF2201T5E: Supplier: LCSC; Manufacturer: UNI-ROYAL(厚声); Supplier Part: C4190; Resistance (Ohms): 2.2K; JLCPCB Part Class: Basic Part
U1 = SN74LVC1G04DBVR: Supplier: LCSC; Manufacturer: TI; Supplier Part: C7827; JLCPCB Part Class: Extended Part
USB-C = KH-TYPE-C-16P: Supplier: LCSC; Supplier Part: C709357; Manufacturer: kinghelm(金航标); Contributor: LCSC; JLCPCB Part Class: Extended Part
VGA = L77HDE15SD1CH4RHNVGA: Contributor: bkastrup
CHARMEM VIDEOMEM = 71321LA55PPGI8: Supplier: LCSC; Supplier Part: C1511714; Manufacturer: RENESAS(瑞萨)/IDT; Contributor: LCSC; JLCPCB Part Class: Extended Part

## Nets
3V3: C14.2 C17.2 C18.2 LDO.2(OUT) LDO.4(OUT) LVLSHF.14(VCC) SD.4(VDD)
GND: BOOTLD.3 BT1.10(GND) BT2.10(GND) BT3.10(GND) BUFFER1.1(1OE#) BUFFER1.10(GND) BUFFER1.19(2OE#) BUZZ-DIS.2 BUZZER.2(-) C1.1 C2.1 C3.1 C4.1 C5.1 C6.1 C7.2 C8.1 C9.1 C10.2(-) C11.1 C12.1 C13.1 C14.1 C15.1 C17.1 C18.1 C19.1 C20.1 C21.1 C22.1 C23.1 C24.1 C25.1 C26.1 C27.1 C28.1 C29.1 C30.1 C31.1 C32.1 C33.1 C34.1 C35.1 C36.1 C37.1 C38.1 C39.1 C40.1 C41.1 C42.1 C43.1 C44.1 C45.1 C46.1 C47.1 C48.1 C49.1 C50.1 C51.1 C52.1 C53.1 C54.1 C55.1 C56.1 C57.1 C58.1 C59.1 C60.1 C61.1 C62.1 C63.1 C64.1 C65.1 C66.1 C67.1 C68.1 C69.1 CHARMEM.19(GND) CHARMEM.39(OER#) CLAMP1.2(A) D1.1 ESD1.1 ESD2.1 ESD3.1 ESD4.2 ESD5.1 ESD6.2 ESD7.1 EXP1.2 EXP1.36 EXP1.38 EXP1.40 FAT-CAT.5(GND) FAT-CAT.20(AREF) FAT-CAT.21(GND) FAT-CAVIA.11(GND) FAT-CAVIA.26(GND) FAT-CAVIA.38(GND) FAT-CAVIA.43(GND) FAT-CAVIA.59(GND) FAT-CAVIA.74(GND) FAT-CAVIA.86(GND) FAT-CAVIA.95(GND) FAT-SCUNK.11(GND) FAT-SCUNK.26(GND) FAT-SCUNK.38(GND) FAT-SCUNK.43(GND) FAT-SCUNK.59(GND) FAT-SCUNK.74(GND) FAT-SCUNK.86(GND) FAT-SCUNK.95(GND) FAT-SPACER.11(GND) FAT-SPACER.26(GND) FAT-SPACER.38(GND) FAT-SPACER.43(GND) FAT-SPACER.59(GND) FAT-SPACER.74(GND) FAT-SPACER.86(GND) FAT-SPACER.95(GND) FB1.2 FTDI.1 HIGH-MEM.14(GND) JTAG-CAVIA.2 JTAG-CAVIA.10 JTAG-SCUNK.2 JTAG-SCUNK.10 JTAG-SPACER.2 JTAG-SPACER.10 LDO.1(ADJ/GND) LOW-MEM.14(GND) LVLSHF.1(1OE#) LVLSHF.4(2OE#) LVLSHF.7(GND) LVLSHF.10(3OE#) LVLSHF.13(4OE#) OR.3(GND) OSC1.2(GND) OSC2.2(GND) PS/2.4(GND) PWR1.1(K) Q1.2(E) Q2.2(E) R8.1 R11.2 SD.6(VSS) SD.10(GND) SD.11(GND) SD.12(GND) SD.13(GND) U1.3(GND) U2.3(GND) U3.3(GND) U4.1(OE) U4.3(GND) U5.1(OE) U5.3(GND) U6.1(OE) U6.3(GND) U7.1(OE) U7.3(GND) U8.1(OE) U8.3(GND) U9.1(OE) U9.3(GND) U10.3(GND) USB-C.1(EP) USB-C.2(EP) USB-C.3(EP) USB-C.4(EP) USB-C.A1(GND) USB-C.A12(GND) USB-C.B1(GND) USB-C.B12(GND) VGA.5 VGA.6 VGA.7 VGA.8 VGA.10 VGA.MH1 VGA.MH2 VIDEOMEM.19(GND) VIDEOMEM.39(OER#) W65C02S.17(VSS) W65C02S.18(VSS) W65C02S.39(VSS) Z80.26(GRN)
VBUS: CLAMP1.1(C) F1.1 USB-C.A4(VBUS) USB-C.A9(VBUS) USB-C.B4(VBUS) USB-C.B9(VBUS)
VBUSY: FAT-SPACER.42(I/O) R62.1 VIDEOMEM.48(BUSYL#)
VCC: BOOTLD.2 BT1.20(VCC) BT2.20(VCC) BT3.20(VCC) BUFFER1.20(VCC) C1.2 C2.2 C3.2 C4.2 C5.2 C6.2 C7.1 C8.2 C9.2 C10.1(+) C11.2 C12.2 C13.2 C15.2 C19.2 C20.2 C21.2 C22.2 C23.2 C24.2 C25.2 C26.2 C27.2 C28.2 C29.2 C30.2 C31.2 C32.2 C33.2 C34.2 C35.2 C36.2 C37.2 C38.2 C39.2 C40.2 C41.2 C42.2 C43.2 C44.2 C45.2 C46.2 C47.2 C48.2 C49.2 C50.2 C51.2 C52.2 C53.2 C54.2 C55.2 C56.2 C57.2 C58.2 C59.2 C60.2 C61.2 C62.2 C63.2 C64.2 C65.2 C66.2 C67.2 C69.2 CHARMEM.45(VCC) F1.2 F2.1 FAT-CAT.4(VCC) FAT-CAT.18(AVCC) FAT-CAVIA.3(VCCIO) FAT-CAVIA.18(VCCIO) FAT-CAVIA.34(VCCIO) FAT-CAVIA.39(VCCINT) FAT-CAVIA.51(VCCIO) FAT-CAVIA.66(VCCIO) FAT-CAVIA.82(VCCIO) FAT-CAVIA.91(VCCINT) FAT-SCUNK.3(VCCIO) FAT-SCUNK.18(VCCIO) FAT-SCUNK.34(VCCIO) FAT-SCUNK.39(VCCINT) FAT-SCUNK.51(VCCIO) FAT-SCUNK.66(VCCIO) FAT-SCUNK.82(VCCIO) FAT-SCUNK.91(VCCINT) FAT-SPACER.3(VCCIO) FAT-SPACER.18(VCCIO) FAT-SPACER.34(VCCIO) FAT-SPACER.39(VCCINT) FAT-SPACER.51(VCCIO) FAT-SPACER.66(VCCIO) FAT-SPACER.82(VCCIO) FAT-SPACER.91(VCCINT) FTDI.3 HIGH-MEM.28(VCC) JTAG-CAVIA.4 JTAG-SCUNK.4 JTAG-SPACER.4 LDO.3(IN) LOW-MEM.28(VCC) OR.5(VCC) OSC1.4(VDD) OSC2.4(VDD) PS/2.1(VCC) R1.2 R4.2 R13.1 R15.2 R16.2 R18.2 R19.2 R20.2 R21.2 R22.2 R27.2 R28.2 R30.2 R32.1 R34.1 R35.2 R41.2 R42.2 R43.2 R44.2 R45.2 R46.2 R47.2 R48.2 R49.2 R50.2 R51.1 R52.2 R53.1 R54.2 R55.2 R56.2 R57.2 R58.2 R59.2 R60.2 R61.2 R62.2 R63.2 R64.2 R65.2 R66.2 R67.2 RN1.1 RN2.1 RN3.1 RN4.5 RN4.6 RN4.7 RN4.8 RN5.5 RN5.6 RN5.7 RN5.8 U1.5(VCC) U2.5(VCC) U3.5(VCC) U4.5(VCC) U5.5(VCC) U6.5(VCC) U7.5(VCC) U8.5(VCC) U9.5(VCC) U10.5(VCC) VIDEOMEM.45(VCC) W65C02S.3(VDD) W65C02S.31(VDD) Z80.6(+5V)
A0: BT2.9(A8) CHARMEM.52(A0L) FAT-SPACER.75(I/O) HIGH-MEM.10(A0) LOW-MEM.10(A0) RN3.9 VIDEOMEM.52(A0L) W65C02S.4(A0) Z80.27(A0)
A1: BT2.8(A7) CHARMEM.1(A1L) FAT-SPACER.72(I/O) HIGH-MEM.9(A1) LOW-MEM.9(A1) RN3.8 VIDEOMEM.1(A1L) W65C02S.5(A1) Z80.28(A1)
A2: BT2.7(A6) CHARMEM.2(A2L) FAT-SPACER.71(I/O) HIGH-MEM.8(A2) LOW-MEM.8(A2) RN3.7 VIDEOMEM.2(A2L) W65C02S.7(A2) Z80.29(A2)
A3: BT2.6(A5) CHARMEM.3(A3L) FAT-SPACER.70(I/O) HIGH-MEM.7(A3) LOW-MEM.7(A3) RN3.6 VIDEOMEM.3(A3L) W65C02S.8(A3) Z80.30(A3)
A4: BT2.5(A4) CHARMEM.4(A4L) FAT-SPACER.69(I/O) HIGH-MEM.6(A4) LOW-MEM.6(A4) RN3.5 VIDEOMEM.4(A4L) W65C02S.9(A4) Z80.31(A4)
A5: BT2.4(A3) CHARMEM.5(A5L) FAT-SPACER.68(I/O) HIGH-MEM.5(A5) LOW-MEM.5(A5) RN3.4 VIDEOMEM.5(A5L) W65C02S.10(A5) Z80.32(A5)
A6: BT2.3(A2) CHARMEM.6(A6L) FAT-SPACER.67(I/O) HIGH-MEM.4(A6) LOW-MEM.4(A6) RN3.3 VIDEOMEM.6(A6L) W65C02S.11(A6) Z80.34(A6)
A7: BT2.2(A1) CHARMEM.7(A7L) FAT-SPACER.65(I/O) HIGH-MEM.3(A7) LOW-MEM.3(A7) RN3.2 VIDEOMEM.7(A7L) W65C02S.12(A7) Z80.35(A7)
A8: BT3.9(A8) CHARMEM.8(A8L) FAT-SPACER.64(I/O) HIGH-MEM.25(A8) LOW-MEM.25(A8) RN2.9 VIDEOMEM.8(A8L) W65C02S.13(A8) Z80.36(A8)
A9: BT3.8(A7) CHARMEM.9(A9L) FAT-SPACER.63(I/O) HIGH-MEM.24(A9) LOW-MEM.24(A9) RN2.8 VIDEOMEM.9(A9L) W65C02S.14(A9) Z80.37(A9)
A10: BT3.7(A6) CHARMEM.50(A10L) FAT-SPACER.61(I/O) HIGH-MEM.21(A10) LOW-MEM.21(A10) RN2.7 VIDEOMEM.50(A10L) W65C02S.15(A10) Z80.38(A10)
A11: BT3.6(A5) FAT-SPACER.60(I/O) HIGH-MEM.23(A11) LOW-MEM.23(A11) RN2.6 W65C02S.16(A11) Z80.40(A11)
A12: BT3.5(A4) FAT-SPACER.58(I/O) HIGH-MEM.2(A12) LOW-MEM.2(A12) RN2.5 W65C02S.19(A12) Z80.41(A12)
A13: BT3.4(A3) FAT-SPACER.57(I/O) HIGH-MEM.26(A13) LOW-MEM.26(A13) RN2.4 W65C02S.20(A13) Z80.42(A13)
A14: BT3.3(A2) FAT-SPACER.56(I/O) HIGH-MEM.1(A14) LOW-MEM.1(A14) RN2.3 W65C02S.21(A14) Z80.43(A14)
A15: BT3.2(A1) FAT-SPACER.55(I/O) RN2.2 W65C02S.22(A15) Z80.44(A15)
AOE: FAT-CAT.25((ADC2/PTCY)PC2) FAT-SPACER.30(I/O)
BE6502: FAT-SPACER.92(I/O) R65.1 W65C02S.34(BE)
BLUE: FAT-SCUNK.71(I/O) U6.2(A)
BMCLK: FAT-SPACER.87(INPUT/GCLK1) R31.1
BOOTRST: BOOTLD.6 C16.2 FAT-CAT.29((RESET#)PC6) R41.1
BPCLK: FAT-SCUNK.87(INPUT/GCLK1) R3.1
BUSREQZ80: FAT-SPACER.99(I/O) R47.1 Z80.22(BUSREQ#)
BXBUSACK: BUFFER1.14(1Y3) EXP1.7 RN4.2
BXBUSREQ: BUFFER1.5(2Y3) FAT-CAT.6(PE1(PTCXY/SCL1/T4))
BXCLK: EXP1.1 R68.2
BXIN: BUFFER1.12(1Y4) FAT-SPACER.14(I/O)
BXIRQ: BUFFER1.3(2Y4) FAT-CAT.22(PE3(PTCY/ADC7/T3/MOSI1))
BXRD: BUFFER1.7(2Y2) FAT-SPACER.19(I/O)
BXSLC: BUFFER1.18(1Y1) EXP1.6 RN5.3
BXWR: BUFFER1.9(2Y1) FAT-SPACER.17(I/O) OR.2(B)
C-TCK: FAT-CAVIA.62(I/O/TCK) JTAG-CAVIA.1
C-TDI: FAT-CAVIA.4(I/O/TDI) JTAG-CAVIA.9 R19.1
C-TDO: FAT-CAVIA.73(I/O/TDO) JTAG-CAVIA.3
C-TMS: FAT-CAVIA.15(I/O/TMS) JTAG-CAVIA.5 R20.1
CA0: FAT-CAVIA.32(I/O) VIDEOMEM.20(I/O0R)
CA1: FAT-CAVIA.31(I/O) VIDEOMEM.21(I/O1R)
CA2: FAT-CAVIA.30(I/O) VIDEOMEM.22(I/O2R)
CA3: FAT-CAVIA.29(I/O) VIDEOMEM.23(I/O3R)
CA4: FAT-CAVIA.28(I/O) VIDEOMEM.24(I/O4R)
CA5: FAT-CAVIA.27(I/O) VIDEOMEM.25(I/O5R)
CA6: FAT-CAVIA.25(I/O) VIDEOMEM.26(I/O6R)
CA7: FAT-CAVIA.24(I/O) VIDEOMEM.27(I/O7R)
CATCLK: FAT-CAT.7((XTAL1/TOSC1)PB6) R23.1
CATRST: C16.1 FTDI.6
CB0: CHARMEM.20(I/O0R) FAT-SCUNK.25(I/O)
CB1: CHARMEM.21(I/O1R) FAT-SCUNK.24(I/O)
CB2: CHARMEM.22(I/O2R) FAT-SCUNK.23(I/O)
CB3: CHARMEM.23(I/O3R) FAT-SCUNK.22(I/O)
CB4: CHARMEM.24(I/O4R) FAT-SCUNK.21(I/O)
CB5: CHARMEM.25(I/O5R) FAT-SCUNK.20(I/O)
CB6: CHARMEM.26(I/O6R) FAT-SCUNK.19(I/O)
CB7: CHARMEM.27(I/O7R) FAT-SCUNK.17(I/O)
CBUSY: CHARMEM.48(BUSYL#) FAT-SPACER.47(I/O) R52.1
CCLK: FAT-CAVIA.87(INPUT/GCLK1) R17.1
CECM: CHARMEM.46(CEL#) FAT-SPACER.48(I/O) R54.1
CEHM: FAT-SPACER.52(I/O) HIGH-MEM.20(CS#) R57.1
CELM: FAT-SPACER.54(I/O) LOW-MEM.20(CS#) R59.1
CEVM: FAT-SPACER.44(I/O) R60.1 VIDEOMEM.46(CEL#)
CLK6502: R25.1 W65C02S.35(PHI2)
CLKZ80: R24.1 Z80.1(CLK)
CMA0: CHARMEM.38(A0R) FAT-CAVIA.33(I/O)
CMA1: CHARMEM.37(A1R) FAT-CAVIA.35(I/O)
CMA2: CHARMEM.36(A2R) FAT-CAVIA.36(I/O)
CMA3: CHARMEM.35(A3R) FAT-CAVIA.40(I/O)
CMA4: CHARMEM.34(A4R) FAT-CAVIA.41(I/0/PD2)
CMA5: CHARMEM.33(A5R) FAT-CAVIA.42(I/O)
CMA6: CHARMEM.32(A6R) FAT-CAVIA.44(I/O)
CMA7: CHARMEM.31(A7R) FAT-CAVIA.45(I/O)
CMA8: CHARMEM.30(A8R) FAT-CAVIA.46(I/O)
CMA9: CHARMEM.29(A9R) FAT-CAVIA.47(I/O)
CMA10: CHARMEM.40(A10R) FAT-CAVIA.48(I/O)
CPUGO: FAT-CAT.11((AIN1/PTCXY)PD7) FAT-SPACER.37(I/O)
CPUIRQ: FAT-CAT.10((OC0A/AIN0/PTCXY)PD6) FAT-SPACER.36(I/O)
CPURST: FAT-CAT.12((CLKO/ICP1/PTCXY)PB0) FAT-SPACER.40(I/O)
CPUSLC: FAT-CAT.9((OC0B/T1/PTCXY)PD5) FAT-SPACER.35(I/O)
CPUSPD: FAT-CAT.13((OC1A/PTCXY)PB1) FAT-SPACER.33(I/O)
CRST: FAT-CAVIA.6(I/O) FAT-SCUNK.81(I/O)
CS: FAT-CAT.14((OC1B/SS0/PTCXY)PB2) R39.2
CS_LLS: LVLSHF.8(3Y) SD.2(CD/DAT3)
D0: BT1.9(A8) CHARMEM.10(I/O0L) FAT-SPACER.76(I/O) HIGH-MEM.11(DQ0) LOW-MEM.11(DQ0) RN1.9 VIDEOMEM.10(I/O0L) W65C02S.30(D0) Z80.9(D0)
D1: BT1.8(A7) CHARMEM.11(I/O1L) FAT-SPACER.77(I/O) HIGH-MEM.12(DQ1) LOW-MEM.12(DQ1) RN1.8 VIDEOMEM.11(I/O1L) W65C02S.29(D1) Z80.10(D1)
D2: BT1.7(A6) CHARMEM.12(I/O2L) FAT-SPACER.78(I/O) HIGH-MEM.13(DQ2) LOW-MEM.13(DQ2) RN1.7 VIDEOMEM.12(I/O2L) W65C02S.28(D2) Z80.7(D2)
D3: BT1.6(A5) CHARMEM.13(I/O3L) FAT-SPACER.79(I/O) HIGH-MEM.15(DQ3) LOW-MEM.15(DQ3) RN1.6 VIDEOMEM.13(I/O3L) W65C02S.27(D3) Z80.3(D3)
D4: BT1.5(A4) CHARMEM.14(I/O4L) FAT-SPACER.80(I/O) HIGH-MEM.16(DQ4) LOW-MEM.16(DQ4) RN1.5 VIDEOMEM.14(I/O4L) W65C02S.26(D4) Z80.2(D4)
D5: BT1.4(A3) CHARMEM.15(I/O5L) FAT-SPACER.81(I/O) HIGH-MEM.17(DQ5) LOW-MEM.17(DQ5) RN1.4 VIDEOMEM.15(I/O5L) W65C02S.25(D5) Z80.4(D5)
D6: BT1.3(A2) CHARMEM.16(I/O6L) FAT-SPACER.83(I/O) HIGH-MEM.18(DQ6) LOW-MEM.18(DQ6) RN1.3 VIDEOMEM.16(I/O6L) W65C02S.24(D6) Z80.5(D6)
D7: BT1.2(A1) CHARMEM.17(I/O7L) FAT-SPACER.84(I/O) HIGH-MEM.19(DQ7) LOW-MEM.19(DQ7) RN1.2 VIDEOMEM.17(I/O7L) W65C02S.23(D7) Z80.8(D7)
DI_LLS: LVLSHF.3(1Y) SD.3(CMD)
DO_LLS: R38.2 SD.7(DAT0)
DPMCE: CHARMEM.44(CER#) FAT-SCUNK.93(I/O) R18.1 VIDEOMEM.44(CER#)
FREE: FAT-CAT.19(PE2(PTCY/ADC6/ICP3/SS1)) FAT-SPACER.21(I/O)
FREE1: FAT-CAVIA.88(INPUT/OE1) FAT-SCUNK.49(I/O)
FREE2: FAT-CAVIA.89(INPUT/GCLR) FAT-SCUNK.48(I/O)
FREE3: FAT-CAVIA.90(INPUT/OE2/GCLK2) FAT-SCUNK.47(I/O)
FREE4: FAT-CAVIA.92(I/O) FAT-SCUNK.46(I/O)
FREE5: FAT-CAVIA.93(I/O) FAT-SCUNK.45(I/O)
FREE6: FAT-CAVIA.63(I/O) FAT-SCUNK.70(I/O)
FREE7: FAT-CAVIA.64(I/O) FAT-SCUNK.69(I/O)
FREE8: FAT-CAVIA.65(I/O) FAT-SCUNK.68(I/O)
FREE9: FAT-CAVIA.75(I/O) FAT-SCUNK.64(I/O)
FREE10: FAT-CAVIA.76(I/O) FAT-SCUNK.50(I/O)
FREE11: FAT-CAVIA.77(I/O) FAT-SCUNK.52(I/O)
FREE12: FAT-CAVIA.78(I/O) FAT-SCUNK.42(I/O)
GREEN: FAT-SCUNK.72(I/O) U5.2(A)
HSP: FAT-SCUNK.98(I/O) U7.2(A)
KCLK: ESD5.2 FAT-CAT.32((OC3B/OC4B/INT0/PTCXY)PD2) PS/2.3(D+)
KDAT: ESD4.1 FAT-CAT.1((OC2B/INT1/PTCXY)PD3) PS/2.2(D-)
LD: FAT-CAT.23((MISO1/ADC0/PTCY)PC0) FAT-SPACER.32(I/O)
MCLK: R14.2 U10.2(A)
MISO: BOOTLD.5 FAT-CAT.16((MISO0/RXD1/PTCXY)PB4) R40.2
MOSI: BOOTLD.4 FAT-CAT.15((MOSI0/TXD1/OC2A/PTCXY)PB3) R36.1
MREQZ80: FAT-SPACER.6(I/O) R43.1 Z80.15(MREQ#)
NMIB6502: FAT-SPACER.94(I/O) R66.1 W65C02S.1(NMIB)
NMIZ80: FAT-SPACER.7(I/O) R42.1 Z80.13(NMI#)
OE: CHARMEM.51(OEL#) FAT-SPACER.46(I/O) HIGH-MEM.22(OE#) LOW-MEM.22(OE#) R50.1 VIDEOMEM.51(OEL#)
PCLK: R12.2 U3.2(A)
RDY6502: FAT-SPACER.97(I/O) R33.1 R49.1
RDZ80: FAT-SPACER.5(I/O) R44.1 Z80.18(RD#)
RED: FAT-SCUNK.75(I/O) U4.2(A)
RST6502: FAT-SPACER.96(I/O) R67.1 W65C02S.38(RESB)
RSTZ80: FAT-SPACER.98(I/O) R48.1 Z80.23(RESET#)
RWB6502: FAT-SPACER.93(I/O) R64.1 W65C02S.32(RWB)
RWCAT: FAT-CAT.24((SCK1/ADC1/PTCY)PC1) FAT-SPACER.31(I/O) R63.1
RWCM: CHARMEM.47(R/WL#) FAT-SPACER.49(I/O) R55.1
RWVM: FAT-SPACER.45(I/O) R61.1 VIDEOMEM.47(R/WL#)
RX: FAT-CAT.30((RXD0/OC3A/PTCXY)PD0) FTDI.4
S-TCK: FAT-SCUNK.62(I/O/TCK) JTAG-SCUNK.1
S-TDI: FAT-SCUNK.4(I/O/TDI) JTAG-SCUNK.9 R21.1
S-TDO: FAT-SCUNK.73(I/O/TDO) JTAG-SCUNK.3
S-TMS: FAT-SCUNK.15(I/O/TMS) JTAG-SCUNK.5 R22.1
SBE: FAT-SCUNK.96(I/O) R2.1
SC: FAT-CAT.26((ADC3/PTCY)PC3) FAT-SPACER.29(I/O)
SCK: BOOTLD.1 FAT-CAT.17((XCK0/SCK0/PTCXY)PB5) R37.1
SCK_LLS: LVLSHF.6(2Y) SD.5(CLK)
SI: FAT-CAT.28((SCL0/ADC5/PTCY)PC5) FAT-SPACER.27(I/O)
SO: FAT-CAT.27((SDA0/ADC4/PTCY)PC4) FAT-SPACER.28(I/O)
SOUND: FAT-CAT.2((XCK0/T0/PTCXY)PD4) U2.2(A)
SP-TCK: FAT-SPACER.62(I/O/TCK) JTAG-SPACER.1
SP-TDI: FAT-SPACER.4(I/O/TDI) JTAG-SPACER.9 R27.1
SP-TDO: FAT-SPACER.73(I/O/TDO) JTAG-SPACER.3
SP-TMS: FAT-SPACER.15(I/O/TMS) JTAG-SPACER.5 R28.1
SPBE: FAT-SPACER.41(I/0/PD2) R29.2
SPRST: FAT-SPACER.22(I/O) Q2.3(C) R30.1 U10.1(OE)
SRST: FAT-SCUNK.76(I/O) Q1.3(C) R4.1 U3.1(OE)
TX: FAT-CAT.31((TXD0/OC4A/PTCXY)PD1) FTDI.5
VMA0: FAT-CAVIA.9(I/O) VIDEOMEM.38(A0R)
VMA1: FAT-CAVIA.10(I/O) VIDEOMEM.37(A1R)
VMA2: FAT-CAVIA.13(I/O) VIDEOMEM.36(A2R)
VMA3: FAT-CAVIA.14(I/O) VIDEOMEM.35(A3R)
VMA4: FAT-CAVIA.16(I/O) VIDEOMEM.34(A4R)
VMA5: FAT-CAVIA.17(I/O) VIDEOMEM.33(A5R)
VMA6: FAT-CAVIA.19(I/O) VIDEOMEM.32(A6R)
VMA7: FAT-CAVIA.20(I/O) VIDEOMEM.31(A7R)
VMA8: FAT-CAVIA.21(I/O) VIDEOMEM.30(A8R)
VMA9: FAT-CAVIA.23(I/O) VIDEOMEM.29(A9R)
VMA10: FAT-CAVIA.8(I/O) VIDEOMEM.40(A10R)
VSP: FAT-SCUNK.97(I/O) U8.2(A)
WAITZ80: FAT-SPACER.100(I/O) R46.1 Z80.21(WAIT#)
WEHM: FAT-SPACER.50(I/O) HIGH-MEM.27(WE#) R56.1
WELM: FAT-SPACER.53(I/O) LOW-MEM.27(WE#) R58.1
WRZ80: FAT-SPACER.2(I/O) R45.1 Z80.19(WR#)
XA0: BT2.11(B8) EXP1.11
XA1: BT2.12(B7) EXP1.12
XA2: BT2.13(B6) EXP1.13
XA3: BT2.14(B5) EXP1.14
XA4: BT2.15(B4) EXP1.15
XA5: BT2.16(B3) EXP1.16
XA6: BT2.17(B2) EXP1.17
XA7: BT2.18(B1) EXP1.18
XA8: BT3.11(B8) EXP1.19
XA9: BT3.12(B7) EXP1.20
XA10: BT3.13(B6) EXP1.21
XA11: BT3.14(B5) EXP1.22
XA12: BT3.15(B4) EXP1.23
XA13: BT3.16(B3) EXP1.24
XA14: BT3.17(B2) EXP1.25
XA15: BT3.18(B1) EXP1.26
XBUSACK: BT2.1(DIR) BT3.1(DIR) BUFFER1.6(1A3) FAT-CAT.3(PE0(PTCXY/SDA1/ICP4/ACO)) FAT-SPACER.1(I/O/PD1) OR.1(A) R53.2
XBUSREQ: BUFFER1.15(2A3) EXP1.5 RN4.1
XCLK: BUFFER1.4(1A2) FAT-SPACER.16(I/O)
XD0: BT1.11(B8) EXP1.27
XD1: BT1.12(B7) EXP1.28
XD2: BT1.13(B6) EXP1.29
XD3: BT1.14(B5) EXP1.30
XD4: BT1.15(B4) EXP1.31
XD5: BT1.16(B3) EXP1.32
XD6: BT1.17(B2) EXP1.33
XD7: BT1.18(B1) EXP1.34
XE: BT1.19(OE#) BT2.19(OE#) BT3.19(OE#) EXP1.4 FAT-SPACER.90(INPUT/OE2/GCLK2) RN5.1
XIN: BUFFER1.8(1A4) EXP1.39 RN5.2
XIRQ: BUFFER1.17(2A4) EXP1.8 RN5.4
XRD: BUFFER1.13(2A2) EXP1.9 RN4.3
XSLC: BUFFER1.2(1A1) FAT-SPACER.20(I/O) R51.2
XWR: BUFFER1.11(2A1) EXP1.10 RN4.4
Net-(BT1-1): BT1.1(DIR) OR.4(Y)
Net-(BUFFER1-16): BUFFER1.16(1Y2) R68.1
Net-(BUZZ-DIS-1): BUZZ-DIS.1 R1.1 U1.2(A)
Net-(BUZZER-1): BUZZER.1(+) U2.4(Y)
Net-(C68-2): C68.2 D1.2 EXP1.3 EXP1.35 EXP1.37 F2.2
Net-(CHARMEM-43): CHARMEM.43(R/WR#) R16.1
Net-(ESD1-2): ESD1.2 R5.2 VGA.1
Net-(ESD2-2): ESD2.2 R6.2 VGA.2
Net-(ESD3-2): ESD3.2 R7.2 VGA.3
Net-(ESD6-1): ESD6.1 R9.2 VGA.13
Net-(ESD7-2): ESD7.2 R10.2 VGA.14
Net-(FAT-SCUNK-100): FAT-SCUNK.100(I/O) R17.2
Net-(FAT-SPACER-23): FAT-SPACER.23(I/O) R25.2
Net-(FAT-SPACER-24): FAT-SPACER.24(I/O) R24.2
Net-(FAT-SPACER-25): FAT-SPACER.25(I/O) R26.2
Net-(FB1-1): FB1.1 PS/2.5 PS/2.6
Net-(LVLSHF-2): LVLSHF.2(1A) R36.2
Net-(LVLSHF-5): LVLSHF.5(2A) R37.2
Net-(LVLSHF-9): LVLSHF.9(3A) R39.1
Net-(LVLSHF-11): LVLSHF.11(4Y) R40.1
Net-(LVLSHF-12): LVLSHF.12(4A) R38.1
Net-(OSC1-3): OSC1.3(OUT) R12.1
Net-(OSC2-3): OSC2.3(OUTPUT) R14.1
Net-(PWR1-2): PWR1.2(A) R13.2
Net-(Q1-1): Q1.1(B) R2.2
Net-(Q2-1): Q2.1(B) R29.1
Net-(R3-2): R3.2 U3.4(Y)
Net-(R5-1): R5.1 U4.4(Y)
Net-(R6-1): R6.1 U5.4(Y)
Net-(R7-1): R7.1 U6.4(Y)
Net-(R8-2): R8.2 USB-C.A5(CC1)
Net-(R9-1): R9.1 U7.4(Y)
Net-(R10-1): R10.1 U8.4(Y)
Net-(R11-1): R11.1 USB-C.B5(CC2)
Net-(R15-1): R15.1 VIDEOMEM.43(R/WR#)
Net-(R23-2): R23.2 U9.4(Y)
Net-(R26-1): R26.1 U9.2(A)
Net-(R31-2): R31.2 U10.4(Y)
Net-(R32-2): R32.2 Z80.12(INT#)
Net-(R33-2): R33.2 W65C02S.41(RDY)
Net-(R34-2): R34.2 W65C02S.43(IRQB)
Net-(R35-1): R35.1 W65C02S.36(SOB)
Net-(U1-4): U1.4(Y) U2.1(OE)

Not connected (* = marked no-connect by the designer): CHARMEM 18(N/C)* 28(N/C)* 41(INTR#)* 42(BUSYR#)* 49(INTL#)*; FAT-CAT 8((XTAL2/TOSC2)PB7)*; FAT-CAVIA 1(I/O/PD1)* 2(I/O)* 5(I/O)* 7(I/O)* 12(I/O)* 22(I/O)* 37(I/O)* 49(I/O)* 50(I/O)* 52(I/O)* 53(I/O)* 54(I/O)* 55(I/O)* 56(I/O)* 57(I/O)* 58(I/O)* 60(I/O)* 61(I/O)* 67(I/O)* 68(I/O)* 69(I/O)* 70(I/O)* 71(I/O)* 72(I/O)* 79(I/O)* 80(I/O)* 81(I/O)* 83(I/O)* 84(I/O)* 85(I/0/GCLK3)* 94(I/O)* 96(I/O)* 97(I/O)* 98(I/O)* 99(I/O)* 100(I/O)*; FAT-SCUNK 1(I/O/PD1)* 2(I/O)* 5(I/O)* 6(I/O)* 7(I/O)* 8(I/O)* 9(I/O)* 10(I/O)* 12(I/O)* 13(I/O)* 14(I/O)* 16(I/O)* 27(I/O)* 28(I/O)* 29(I/O)* 30(I/O)* 31(I/O)* 32(I/O)* 33(I/O)* 35(I/O)* 36(I/O)* 37(I/O)* 40(I/O)* 41(I/0/PD2)* 44(I/O)* 53(I/O)* 54(I/O)* 55(I/O)* 56(I/O)* 57(I/O)* 58(I/O)* 60(I/O)* 61(I/O)* 63(I/O)* 65(I/O)* 67(I/O)* 77(I/O)* 78(I/O)* 79(I/O)* 80(I/O)* 83(I/O)* 84(I/O)* 85(I/0/GCLK3)* 88(INPUT/OE1)* 89(INPUT/GCLR)* 90(INPUT/OE2/GCLK2)* 92(I/O)* 94(I/O)* 99(I/O)*; FAT-SPACER 8(I/O)* 9(I/O)* 10(I/O)* 12(I/O)* 13(I/O)* 85(I/0/GCLK3)* 88(INPUT/OE1)* 89(INPUT/GCLR)*; FTDI 2*; JTAG-CAVIA 6* 7* 8*; JTAG-SCUNK 6* 7* 8*; JTAG-SPACER 6* 7* 8*; OSC1 1(OE#)*; OSC2 1(Tri-state)*; SD 1(DAT2)* 8(DAT1)* 9(CD)*; U1 1(N.C)*; USB-C A6(DP1)* A7(DN1)* A8(SUB1)* B6(DP2)* B7(DN2)* B8(SUB2)*; VGA 4* 9* 11* 12* 15*; VIDEOMEM 18(N/C)* 28(N/C)* 41(INTR#)* 42(BUSYR#)* 49(INTL#)*; W65C02S 2(SYNC)* 6(NC)* 33(NC)* 37(PHI2O)* 40(VPB)* 42(PHI1O)* 44(MLB)*; Z80 11(NC)* 14(HALT#)* 16(IORQ#)* 17(NC)* 20(BUSACK#)* 24(M1#)* 25(REFH#)* 33(NC)* 39(NC)*
